# Altium project Flight-Controller.PrjPcb (part 1 of 2)
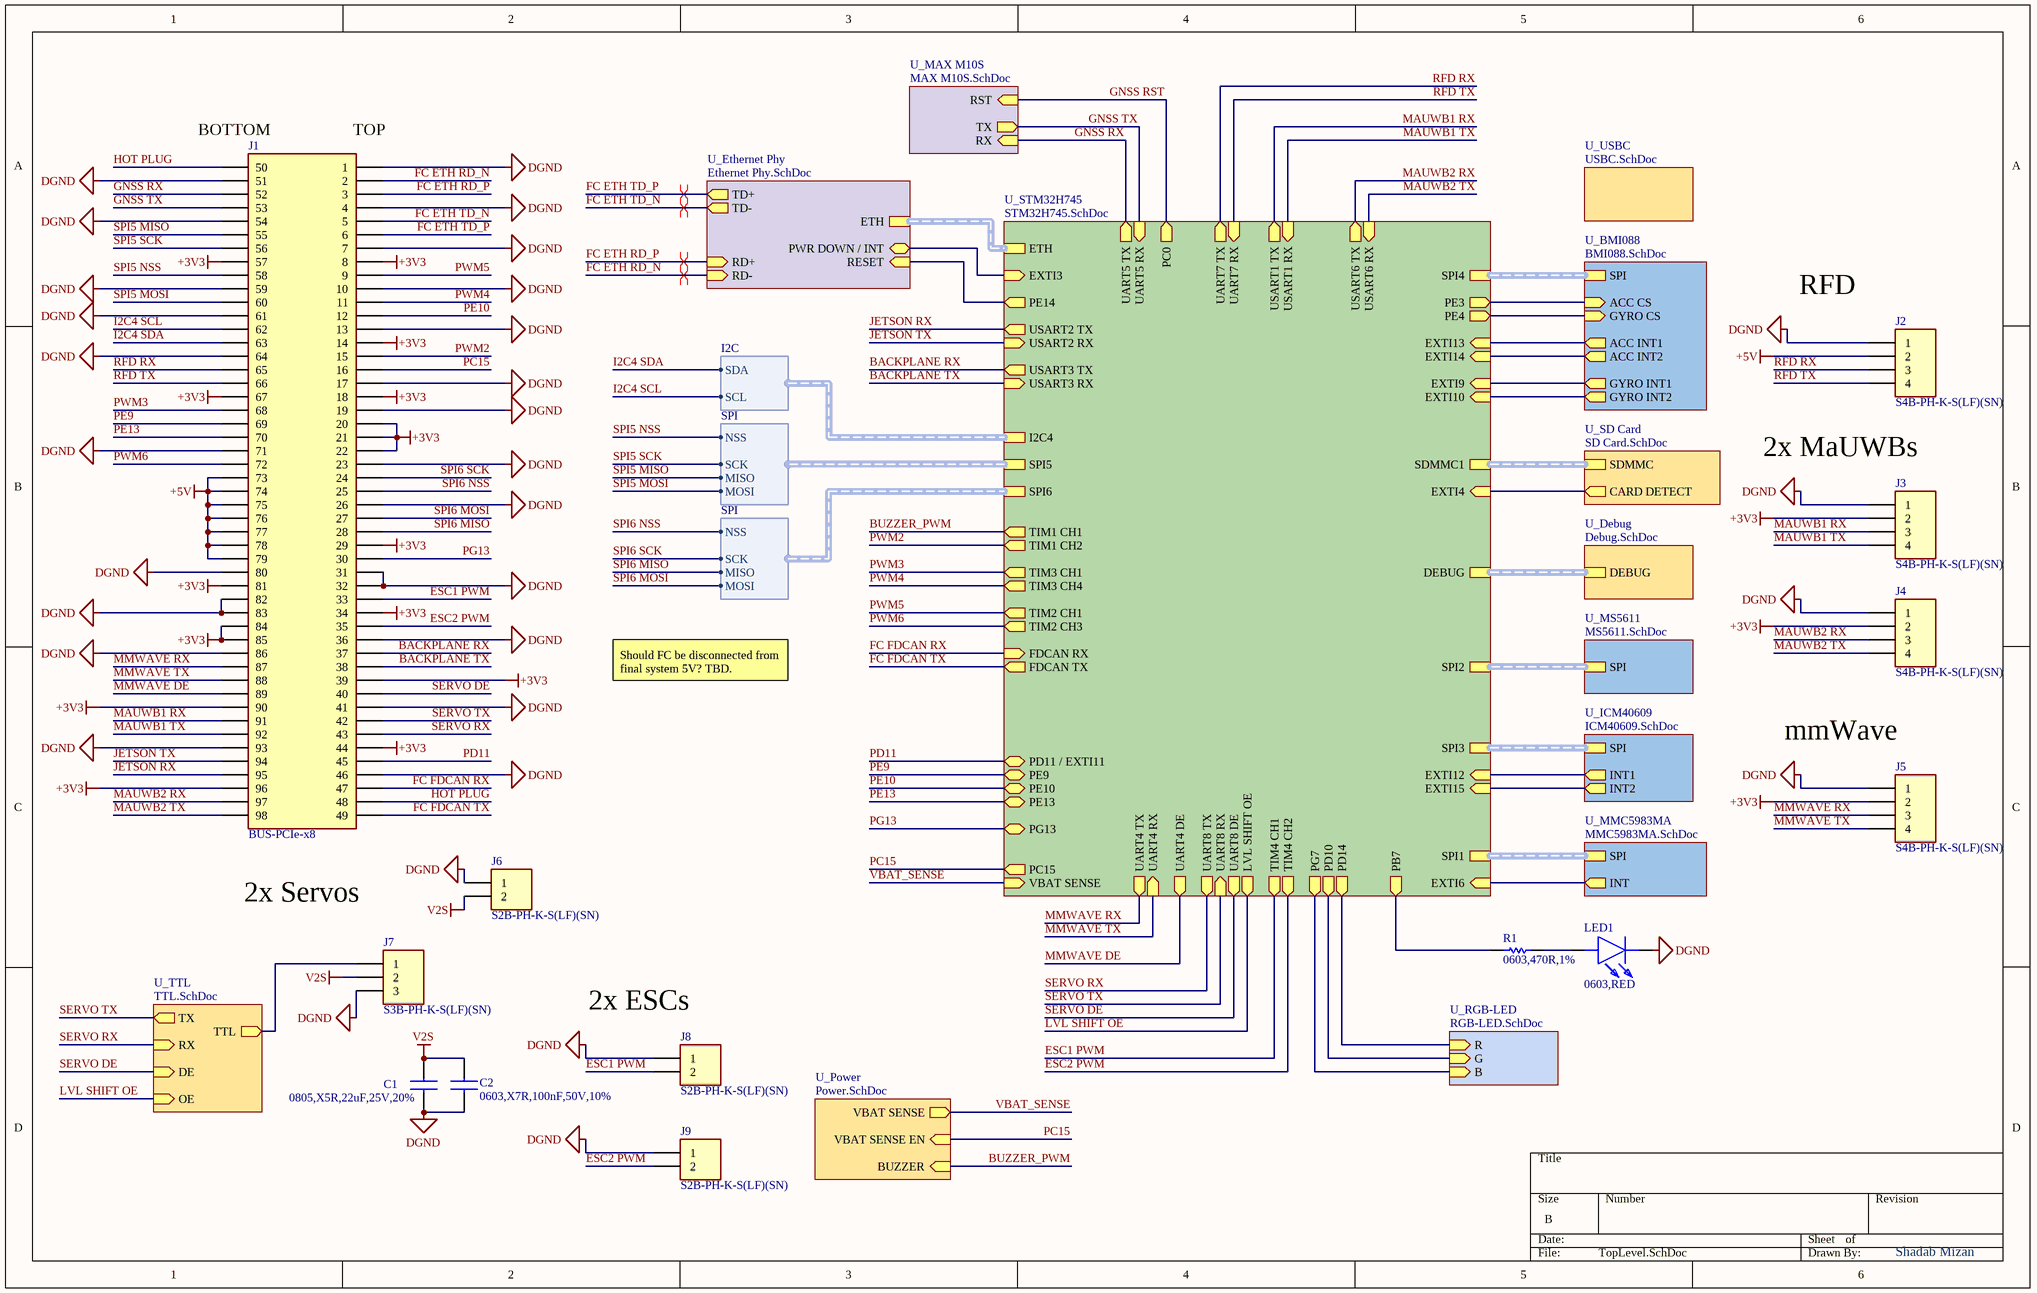
[diagram p0: TopLevel.SchDoc]
14 sheets, 188 parts. Net scope: hierarchical (ports join the sheet entries above them; power ports are global).
Board file: Flight-Controller.PcbDoc
Sheets:
  TopLevel.SchDoc
    U_STM32H745 = STM32H745.SchDoc
    U_MMC5983MA = MMC5983MA.SchDoc
    U_SD Card = SD Card.SchDoc
    U_ICM40609 = ICM40609.SchDoc
    U_MS5611 = MS5611.SchDoc
    U_MAX M10S = MAX M10S.SchDoc
    U_USBC = USBC.SchDoc
    U_BMI088 = BMI088.SchDoc
    U_Debug = Debug.SchDoc
    U_Ethernet Phy = Ethernet Phy.SchDoc
    U_TTL = TTL.SchDoc
    U_Power = Power.SchDoc
    U_RGB-LED = RGB-LED.SchDoc

## Sheet TopLevel.SchDoc
size B; SheetNumber: 1; SheetTotal: 14

### Parts
C1  0805,X5R,22uF,25V,20%  [CAPC2012X145N]
C2  0603,X7R,100nF,50V,10%  [CAPC1608X90N]
J1  BUS-PCIe-x8  [BUS_PCIexpress_x8]  (no BOM)
J2  S4B-PH-K-S(LF)(SN)  [S4B-PH-K-S-_LF_SN]
J3  S4B-PH-K-S(LF)(SN)  [S4B-PH-K-S-_LF_SN]
J4  S4B-PH-K-S(LF)(SN)  [S4B-PH-K-S-_LF_SN]
J5  S4B-PH-K-S(LF)(SN)  [S4B-PH-K-S-_LF_SN]
J6  S2B-PH-K-S(LF)(SN)  [S2B-PH-K-S_LF_SN]
J7  S3B-PH-K-S(LF)(SN)  [S3B-PH-K-S-_LF_SN]
J8  S2B-PH-K-S(LF)(SN)  [S2B-PH-K-S_LF_SN]
J9  S2B-PH-K-S(LF)(SN)  [S2B-PH-K-S_LF_SN]
LED1  0603,RED  [LEDC1608X36N]
R1  0603,470R,1%  [RESC1608X90N]

### Sub-sheets
U_BMI088 = BMI088.SchDoc: ACC CS (in), GYRO CS (in), SPI (harness SPI), ACC INT1 (out), ACC INT2 (out), GYRO INT1 (out), GYRO INT2 (out)
U_Debug = Debug.SchDoc: DEBUG (harness DEBUG)
U_Ethernet Phy = Ethernet Phy.SchDoc: ETH (harness ETH), TD+ (out), TD- (out), RD+ (in), RD- (in), PWR DOWN / INT (bidir), RESET (in)
U_ICM40609 = ICM40609.SchDoc: INT1 (out), INT2 (out), SPI (harness SPI)
U_MAX M10S = MAX M10S.SchDoc: RX (in), TX (out), RST (in)
U_MMC5983MA = MMC5983MA.SchDoc: INT (out), SPI (harness SPI)
U_MS5611 = MS5611.SchDoc: SPI (harness SPI)
U_Power = Power.SchDoc: VBAT SENSE (out), BUZZER (in), VBAT SENSE EN (in)
U_RGB-LED = RGB-LED.SchDoc: R (in), G (in), B (in)
U_SD Card = SD Card.SchDoc: SDMMC (harness SDMMC), CARD DETECT (out)
U_STM32H745 = STM32H745.SchDoc: SPI1 (harness SPI), SPI2 (harness SPI), SPI3 (harness SPI), SPI4 (harness SPI), SPI5 (harness SPI), SPI6 (harness SPI), I2C4 (harness I2C), SDMMC1 (harness SDMMC), ETH (harness ETH), PE3 (out), PE4 (out), EXTI13 (in), EXTI14 (in), EXTI9 (in), EXTI10 (in), EXTI4 (in), EXTI12 (in), EXTI15 (in), FDCAN TX (out), FDCAN RX (in), UART4 TX (out), UART4 RX (in), UART4 DE (out), UART8 TX (out), UART8 RX (in), USART6 TX (out), USART6 RX (in), USART2 TX (out), USART2 RX (in), USART3 TX (out), USART3 RX (in), UART7 TX (out), UART7 RX (in), UART5 RX (in), UART5 TX (out), EXTI6 (in), PC0 (out), TIM1 CH1 (out), TIM1 CH2 (out), TIM3 CH1 (out), TIM3 CH4 (out), DEBUG (harness SPI), TIM4 CH1 (out), TIM4 CH2 (out), TIM2 CH1 (out), TIM2 CH3 (out), EXTI3 (in), PG13 (bidir), PE10 (bidir), PE13 (bidir), UART8 DE (out), USART1 TX (out), USART1 RX (in), LVL SHIFT OE (out), PE14 (out), PD11 / EXTI11 (bidir), VBAT SENSE (in), PE9 (bidir), PC15 (out), PG7 (out), PD10 (out), PD14 (out), PB7 (out)
U_TTL = TTL.SchDoc: TX (out), OE (in), DE (in), RX (in), TTL (out)
U_USBC = USBC.SchDoc: no entries

### Harnesses
SPI: NSS, SCK, MISO, MOSI
I2C: SDA, SCL

### Nets
+3V3: J1.8 J1.14 J1.18 J1.20 J1.21 J1.22 J1.29 J1.34 J1.39 J1.44 J1.57 J1.67 J1.81 J1.84 J1.85 J1.90 J1.96 J3.2 J4.2 J5.2
+5V: J1.73 J1.74 J1.75 J1.76 J1.77 J1.78 J1.79 J2.2
DGND: C1.1 C2.1 J1.1 J1.4 J1.7 J1.10 J1.13 J1.17 J1.19 J1.23 J1.26 J1.31 J1.32 J1.36 J1.41 J1.46 J1.51 J1.54 J1.59 J1.61 J1.64 J1.71 J1.80 J1.82 J1.83 J1.86 J1.93 J2.1 J3.1 J4.1 J5.1 J6.1 J7.3 J8.1 J9.1 LED1.1(K)
V2S: C1.2 C2.2 J6.2 J7.2
BACKPLANE RX: J1.37 ; sheet U_STM32H745/USART3 TX
BACKPLANE TX: J1.38 ; sheet U_STM32H745/USART3 RX
BMI_ACC_CS: sheet U_STM32H745/PE3, sheet U_BMI088/ACC CS
BMI_ACC_INT1: sheet U_STM32H745/EXTI13, sheet U_BMI088/ACC INT1
BMI_ACC_INT2: sheet U_STM32H745/EXTI14, sheet U_BMI088/ACC INT2
BMI_GYRO_CS: sheet U_STM32H745/PE4, sheet U_BMI088/GYRO CS
BMI_GYRO_INT1: sheet U_STM32H745/EXTI9, sheet U_BMI088/GYRO INT1
BMI_GYRO_INT2: sheet U_STM32H745/EXTI10, sheet U_BMI088/GYRO INT2
BUZZER_PWM: sheet U_STM32H745/TIM1 CH1, sheet U_Power/BUZZER
ESC1 PWM: J1.33 J8.2 ; sheet U_STM32H745/TIM4 CH1
ESC2 PWM: J1.35 J9.2 ; sheet U_STM32H745/TIM4 CH2
FC ETH RD_N: J1.2 ; sheet U_Ethernet Phy/RD-
FC ETH RD_P: J1.3 ; sheet U_Ethernet Phy/RD+
FC ETH TD_N: J1.5 ; sheet U_Ethernet Phy/TD-
FC ETH TD_P: J1.6 ; sheet U_Ethernet Phy/TD+
FC FDCAN RX: J1.47 ; sheet U_STM32H745/FDCAN RX
FC FDCAN TX: J1.49 ; sheet U_STM32H745/FDCAN TX
GNSS RST: sheet U_STM32H745/PC0, sheet U_MAX M10S/RST
GNSS RX: J1.52 ; sheet U_STM32H745/UART5 TX, sheet U_MAX M10S/RX
GNSS TX: J1.53 ; sheet U_STM32H745/UART5 RX, sheet U_MAX M10S/TX
HOT PLUG: J1.48 J1.50
I2C4 SCL: J1.62 ; sheet U_STM32H745/I2C4.SCL
I2C4 SDA: J1.63 ; sheet U_STM32H745/I2C4.SDA
ICM_INT1: sheet U_STM32H745/EXTI12, sheet U_ICM40609/INT1
ICM_INT2: sheet U_STM32H745/EXTI15, sheet U_ICM40609/INT2
JETSON RX: J1.95 ; sheet U_STM32H745/USART2 TX
JETSON TX: J1.94 ; sheet U_STM32H745/USART2 RX
LVL SHIFT OE: sheet U_STM32H745/LVL SHIFT OE, sheet U_TTL/OE
MAUWB1 RX: J1.91 J3.3 ; sheet U_STM32H745/USART1 TX
MAUWB1 TX: J1.92 J3.4 ; sheet U_STM32H745/USART1 RX
MAUWB2 RX: J1.97 J4.3 ; sheet U_STM32H745/USART6 TX
MAUWB2 TX: J1.98 J4.4 ; sheet U_STM32H745/USART6 RX
MMC_INT: sheet U_STM32H745/EXTI6, sheet U_MMC5983MA/INT
MMWAVE DE: J1.89 ; sheet U_STM32H745/UART4 DE
MMWAVE RX: J1.87 J5.3 ; sheet U_STM32H745/UART4 TX
MMWAVE TX: J1.88 J5.4 ; sheet U_STM32H745/UART4 RX
PC15: J1.16 ; sheet U_STM32H745/PC15, sheet U_Power/VBAT SENSE EN
PD11: J1.45 ; sheet U_STM32H745/PD11 / EXTI11  [project net EXTRA_PD11]
PE9: J1.69 ; sheet U_STM32H745/PE9  [project net EXTRA_PE9]
PE10: J1.12 ; sheet U_STM32H745/PE10  [project net EXTRA_PE10]
PE13: J1.70 ; sheet U_STM32H745/PE13  [project net EXTRA_PE13]
PG13: J1.30 ; sheet U_STM32H745/PG13  [project net EXTRA_PG13]
PHY_INT: sheet U_STM32H745/EXTI3, sheet U_Ethernet Phy/PWR DOWN / INT
PHY_RST: sheet U_STM32H745/PE14, sheet U_Ethernet Phy/RESET
PWM2: J1.15 ; sheet U_STM32H745/TIM1 CH2
PWM3: J1.68 ; sheet U_STM32H745/TIM3 CH1
PWM4: J1.11 ; sheet U_STM32H745/TIM3 CH4
PWM5: J1.9 ; sheet U_STM32H745/TIM2 CH1
PWM6: J1.72 ; sheet U_STM32H745/TIM2 CH3
RFD RX: J1.65 J2.3 ; sheet U_STM32H745/UART7 TX
RFD TX: J1.66 J2.4 ; sheet U_STM32H745/UART7 RX
RGB_B: sheet U_STM32H745/PD10, sheet U_RGB-LED/G
RGB_G: sheet U_STM32H745/PD14, sheet U_RGB-LED/R
RGB_R: sheet U_STM32H745/PG7, sheet U_RGB-LED/B
SD_CARD_DETECT: sheet U_STM32H745/EXTI4, sheet U_SD Card/CARD DETECT
SERVO DE: J1.40 ; sheet U_STM32H745/UART8 DE, sheet U_TTL/DE
SERVO RX: J1.43 ; sheet U_STM32H745/UART8 TX, sheet U_TTL/RX
SERVO TX: J1.42 ; sheet U_STM32H745/UART8 RX, sheet U_TTL/TX
SPI5 MISO: J1.55 ; sheet U_STM32H745/SPI5.MISO
SPI5 MOSI: J1.60 ; sheet U_STM32H745/SPI5.MOSI
SPI5 NSS: J1.58 ; sheet U_STM32H745/SPI5.NSS
SPI5 SCK: J1.56 ; sheet U_STM32H745/SPI5.SCK
SPI6 MISO: J1.28 ; sheet U_STM32H745/SPI6.MISO
SPI6 MOSI: J1.27 ; sheet U_STM32H745/SPI6.MOSI
SPI6 NSS: J1.25 ; sheet U_STM32H745/SPI6.NSS
SPI6 SCK: J1.24 ; sheet U_STM32H745/SPI6.SCK
STAT_LEDR: R1.1 ; sheet U_STM32H745/PB7
VBAT_SENSE: sheet U_STM32H745/VBAT SENSE, sheet U_Power/VBAT SENSE  [project net ADC1_INP9]
NetIC12_2: J7.1 ; sheet U_TTL/TTL
NetLED1_2: LED1.2(A) R1.2

### Buses and harness runs
harness sheet U_BMI088/SPI = sheet U_STM32H745/SPI4
harness sheet U_Debug/DEBUG = sheet U_STM32H745/DEBUG
harness sheet U_Ethernet Phy/ETH = sheet U_STM32H745/ETH
harness sheet U_ICM40609/SPI = sheet U_STM32H745/SPI3
harness sheet U_MMC5983MA/SPI = sheet U_STM32H745/SPI1
harness sheet U_MS5611/SPI = sheet U_STM32H745/SPI2
harness sheet U_SD Card/SDMMC = sheet U_STM32H745/SDMMC1

### Layout directives
differential pair: FC ETH RD_N, FC ETH RD_P, FC ETH TD_N, FC ETH TD_P

### Notes on the sheet
- (near J1) BOTTOM
- (near J1) TOP
- RFD
- 2x MaUWBs
- Should FC be disconnected from final system 5V? TBD.
- mmWave
- 2x Servos
- (near J8) 2x ESCs
- Shadab Mizan

### Library data of the parts
C1 = CL21A226MAQNNNE: 22uF ±20% 25V Ceramic Capacitor X5R 0805; LCSC Part #: C45783; Manu Part #: CL21A226MAQNNNE
C2 = CC0603KRX7R9BB104: 50V 100nF X7R ±10% 0603 Multilayer Ceramic Capacitors MLCC - SMD/SMT ROHS; LCSC Part #: C14663; Manu Part #: CC0603KRX7R9BB104
J1 = BUS-PCIe-x8: PCIe x8
J2-J5 = S4B-PH-K-S(LF)(SN): Connector Header 4 position 2mm Pitch 2A Right Angle -25℃~+85℃; LCSC Part #: C157926; Manu Part #: S4B-PH-K-S(LF)(SN)
J6 J8 J9 = S2B-PH-K-S(LF)(SN): Connector Header 2 position 2mm Pitch 2A Right Angle -25℃~+85℃; LCSC Part #: C173752; Manu Part #: S2B-PH-K-S(LF)(SN)
J7 = S3B-PH-K-S(LF)(SN): Connector Header 3 position 2mm Pitch 2A Right Angle -25℃~+85℃; LCSC Part #: C157929; Manu Part #: S3B-PH-K-S(LF)(SN)
LED1 = KT-0603R: -40℃~+85℃ 1.8V~2.4V 120° 20mA 300mcd 40mW 615nm~630nm 645nm Discrete Diode Red Water Clear 0603 LED Indication - Discrete ROHS; Manu Part #: KT-0603R; LCSC Part #: C2286
R1 = 0603WAF4700T5E: -55℃~+155℃ 100mW 470Ω 75V Thick Film Resistor ±1% ±100ppm/℃ 0603 Chip Resistor - Surface Mount ROHS; LCSC Part #: C23179; Manu Part #: 0603WAF4700T5E

## Sheet STM32H745.SchDoc
size C; SheetNumber: 2; SheetTotal: 14
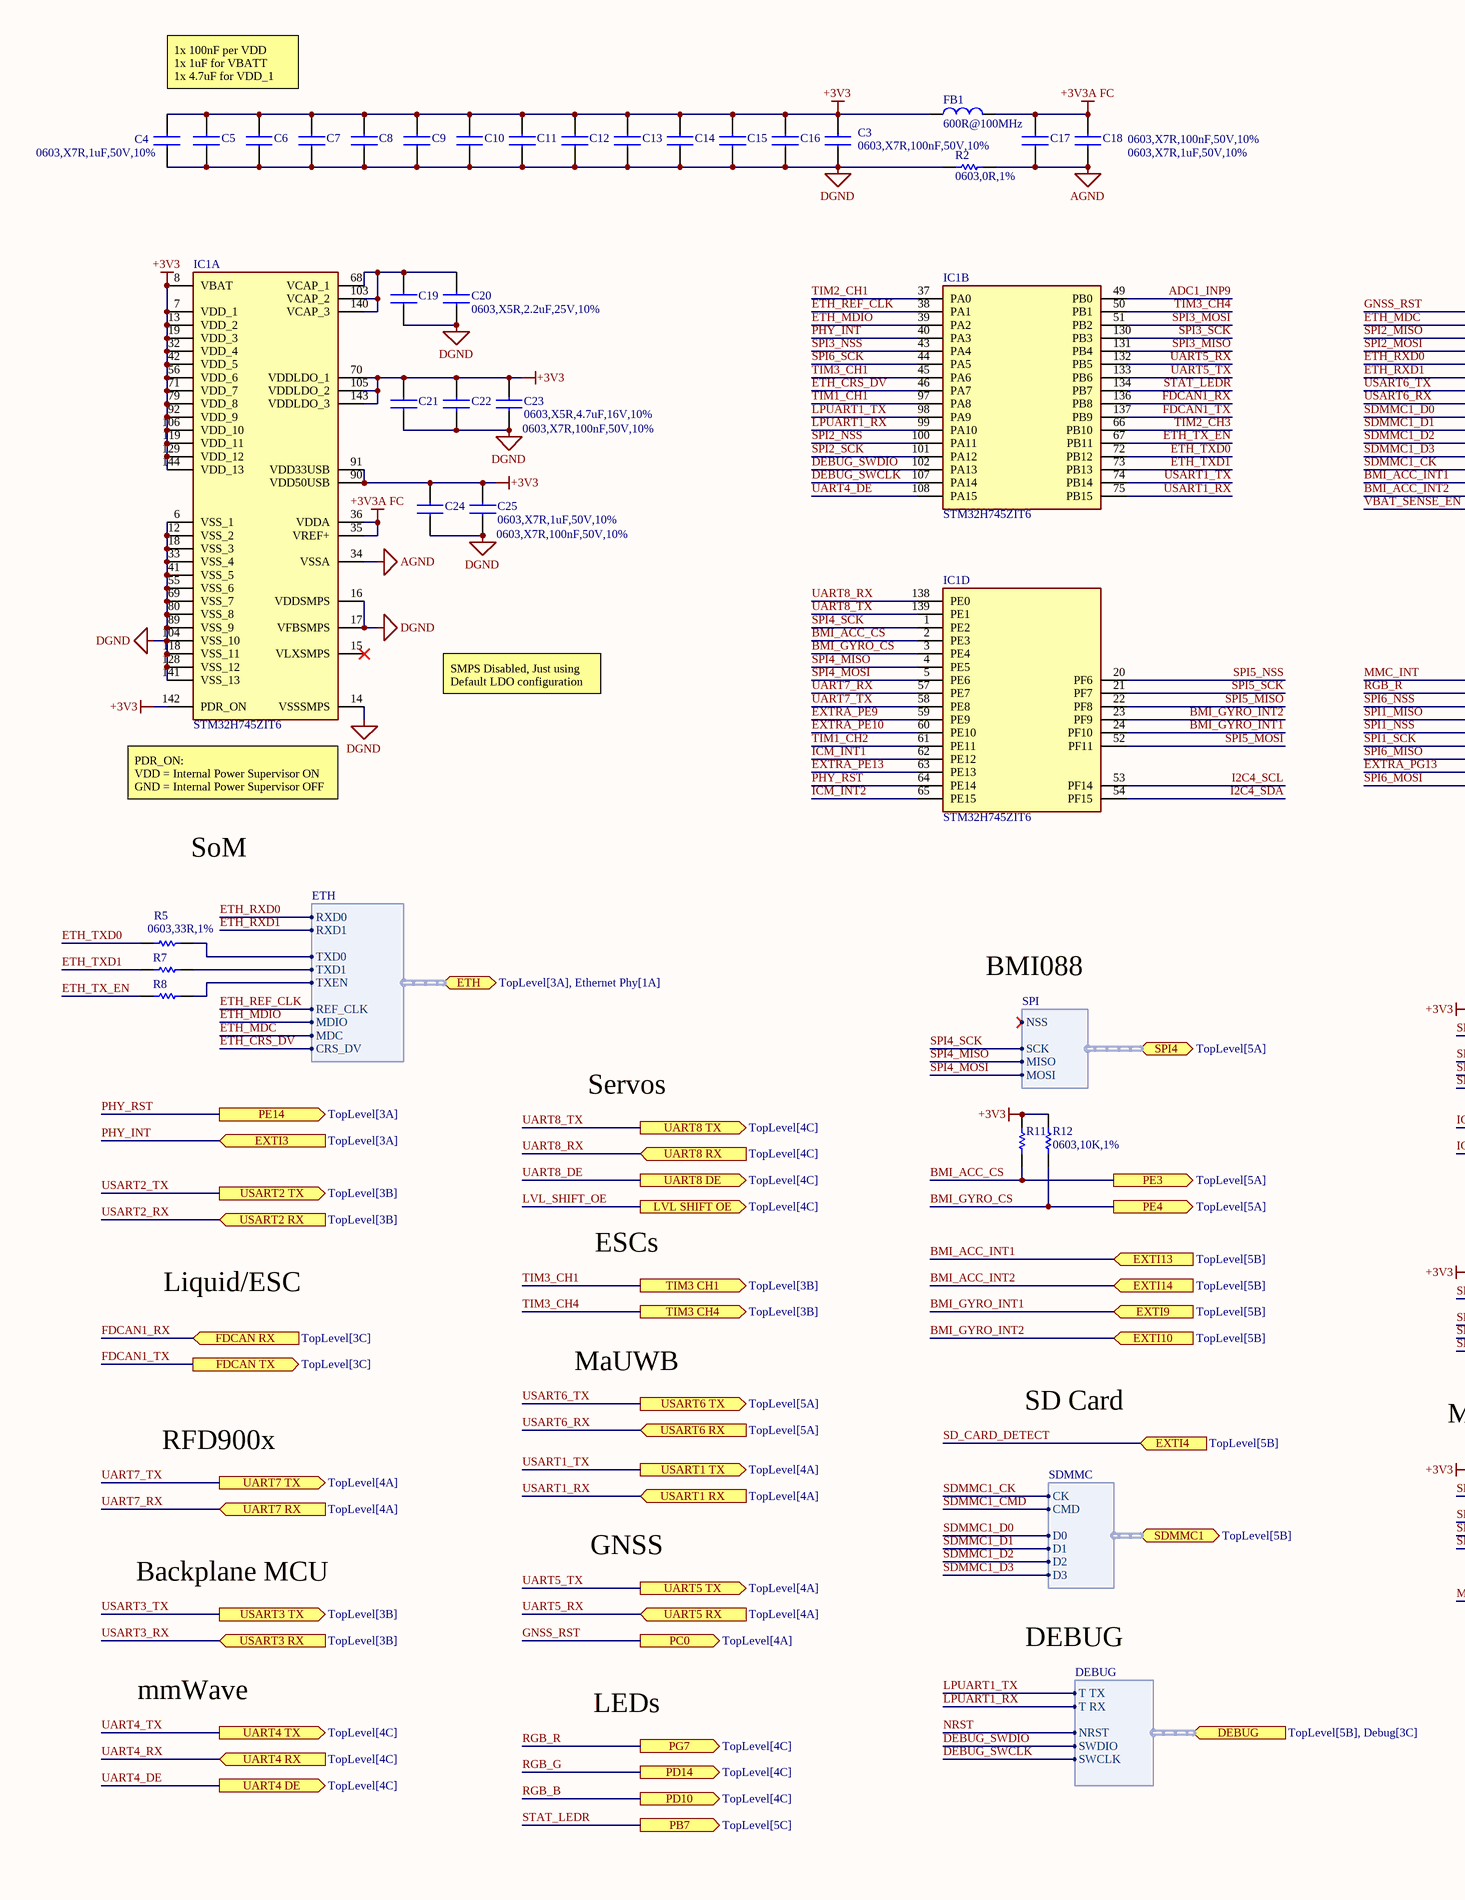
[diagram p1: STM32H745.SchDoc, left]
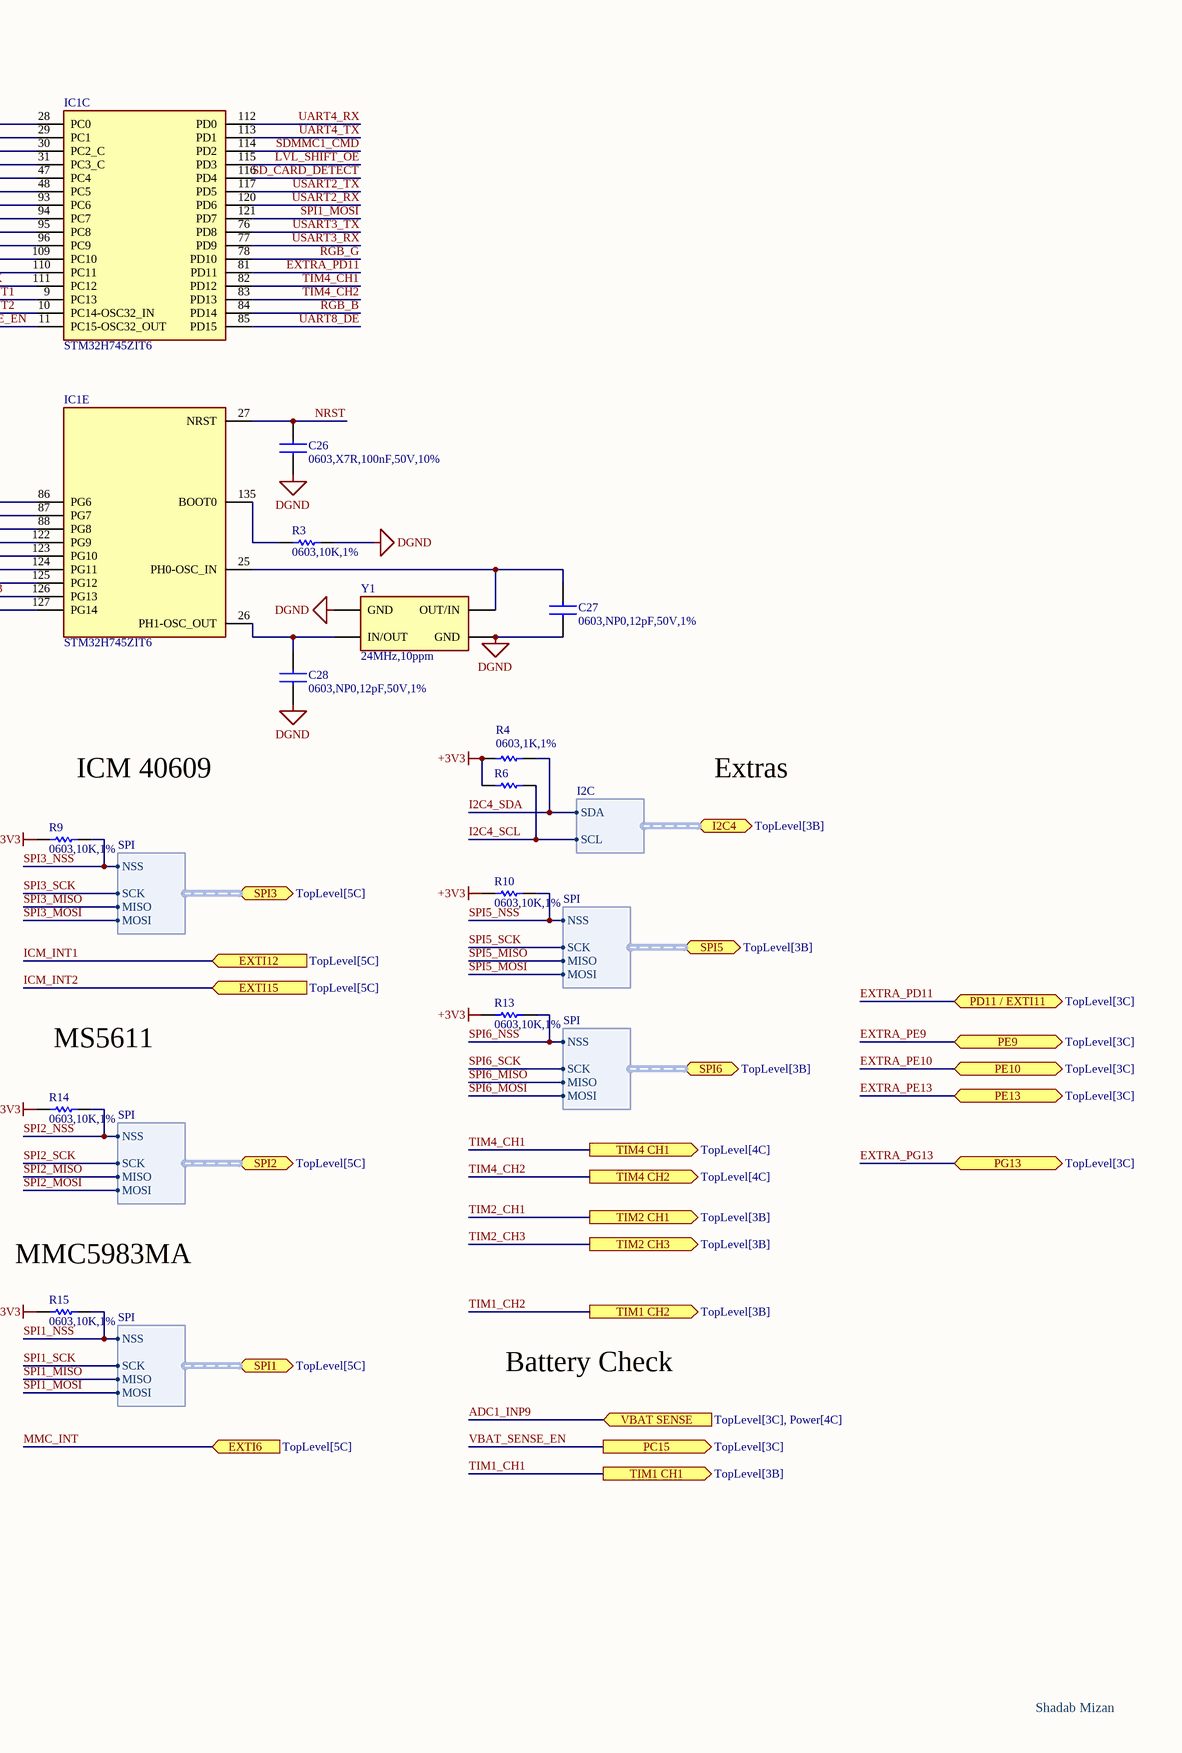
[diagram p2: STM32H745.SchDoc, right]

### Parts
C3  0603,X7R,100nF,50V,10%  [CAPC1608X90N]
C4  0603,X7R,1uF,50V,10%  [CAPC1608X90N]
C5  0603,X7R,100nF,50V,10%  [CAPC1608X90N]  (value not drawn)
C6  0603,X7R,100nF,50V,10%  [CAPC1608X90N]  (value not drawn)
C7  0603,X7R,100nF,50V,10%  [CAPC1608X90N]  (value not drawn)
C8  0603,X7R,100nF,50V,10%  [CAPC1608X90N]  (value not drawn)
C9  0603,X7R,100nF,50V,10%  [CAPC1608X90N]  (value not drawn)
C10  0603,X7R,100nF,50V,10%  [CAPC1608X90N]  (value not drawn)
C11  0603,X7R,100nF,50V,10%  [CAPC1608X90N]  (value not drawn)
C12  0603,X7R,100nF,50V,10%  [CAPC1608X90N]  (value not drawn)
C13  0603,X7R,100nF,50V,10%  [CAPC1608X90N]  (value not drawn)
C14  0603,X7R,100nF,50V,10%  [CAPC1608X90N]  (value not drawn)
C15  0603,X7R,100nF,50V,10%  [CAPC1608X90N]  (value not drawn)
C16  0603,X7R,100nF,50V,10%  [CAPC1608X90N]  (value not drawn)
C17  0603,X7R,100nF,50V,10%  [CAPC1608X90N]
C18  0603,X7R,1uF,50V,10%  [CAPC1608X90N]
C19  0603,X5R,2.2uF,25V,10%  [CAPC1608X90N]  (value not drawn)
C20  0603,X5R,2.2uF,25V,10%  [CAPC1608X90N]
C21  0603,X7R,100nF,50V,10%  [CAPC1608X90N]  (value not drawn)
C22  0603,X7R,100nF,50V,10%  [CAPC1608X90N]
C23  0603,X5R,4.7uF,16V,10%  [CAPC1608X90N]
C24  0603,X7R,100nF,50V,10%  [CAPC1608X90N]
C25  0603,X7R,1uF,50V,10%  [CAPC1608X90N]
C26  0603,X7R,100nF,50V,10%  [CAPC1608X90N]
C27  0603,NP0,12pF,50V,1%  [CAPC1608X90N]
C28  0603,NP0,12pF,50V,1%  [CAPC1608X90N]
FB1  600R@100MHz  [BLM18SP221SN1B]
IC1  STM32H745ZIT6  [QFP50P2200X2200X160-144N]  (parts A,B,C,D,E of 5)
R2  0603,0R,1%  [RESC1608X90N]
R3  0603,10K,1%  [RESC1608X90N]
R4  0603,1K,1%  [RESC1608X90N]
R5  0603,33R,1%  [RESC1608X90N]
R6  0603,1K,1%  [RESC1608X90N]  (value not drawn)
R7  0603,33R,1%  [RESC1608X90N]  (value not drawn)
R8  0603,33R,1%  [RESC1608X90N]  (value not drawn)
R9  0603,10K,1%  [RESC1608X90N]
R10  0603,10K,1%  [RESC1608X90N]
R11  0603,10K,1%  [RESC1608X90N]  (value not drawn)
R12  0603,10K,1%  [RESC1608X90N]
R13  0603,10K,1%  [RESC1608X90N]
R14  0603,10K,1%  [RESC1608X90N]
R15  0603,10K,1%  [RESC1608X90N]
Y1  24MHz,10ppm  [CRYSTAL-SMD_4P-L3.2-W2.5-BL]

### Ports
DEBUG (in, harness DEBUG, see TopLevel[5B], Debug[3C]), ETH (bidir, harness ETH, see TopLevel[3A], Ethernet Phy[1A]), EXTI3 (in, see TopLevel[3A]), EXTI4 (in, see TopLevel[5B]), EXTI6 (in, see TopLevel[5C]), EXTI9 (in, see TopLevel[5B]), EXTI10 (in, see TopLevel[5B]), EXTI12 (in, see TopLevel[5C]), EXTI13 (in, see TopLevel[5B]), EXTI14 (in, see TopLevel[5B]), EXTI15 (in, see TopLevel[5C]), FDCAN RX (in, see TopLevel[3C]), FDCAN TX (out, see TopLevel[3C]), I2C4 (bidir, harness I2C, see TopLevel[3B]), LVL SHIFT OE (out, see TopLevel[4C]), PB7 (out, see TopLevel[5C]), PC0 (out, see TopLevel[4A]), PC15 (out, see TopLevel[3C]), PD10 (out, see TopLevel[4C]), PD11 / EXTI11 (bidir, see TopLevel[3C]), PD14 (out, see TopLevel[4C]), PE3 (out, see TopLevel[5A]), PE4 (out, see TopLevel[5A]), PE9 (bidir, see TopLevel[3C]), PE10 (bidir, see TopLevel[3C]), PE13 (bidir, see TopLevel[3C]), PE14 (out, see TopLevel[3A]), PG7 (out, see TopLevel[4C]), PG13 (bidir, see TopLevel[3C]), SDMMC1 (bidir, harness SDMMC, see TopLevel[5B]), SPI1 (bidir, harness SPI, see TopLevel[5C]), SPI2 (bidir, harness SPI, see TopLevel[5C]), SPI3 (bidir, harness SPI, see TopLevel[5C]), SPI4 (bidir, harness SPI, see TopLevel[5A]), SPI5 (bidir, harness SPI, see TopLevel[3B]), SPI6 (bidir, harness SPI, see TopLevel[3B]), TIM1 CH1 (out, see TopLevel[3B]), TIM1 CH2 (out, see TopLevel[3B]), TIM2 CH1 (out, see TopLevel[3B]), TIM2 CH3 (out, see TopLevel[3B]), TIM3 CH1 (out, see TopLevel[3B]), TIM3 CH4 (out, see TopLevel[3B]), TIM4 CH1 (out, see TopLevel[4C]), TIM4 CH2 (out, see TopLevel[4C]), UART4 DE (out, see TopLevel[4C]), UART4 RX (in, see TopLevel[4C]), UART4 TX (out, see TopLevel[4C]), UART5 RX (in, see TopLevel[4A]), UART5 TX (out, see TopLevel[4A]), UART7 RX (in, see TopLevel[4A]), UART7 TX (out, see TopLevel[4A]), UART8 DE (out, see TopLevel[4C]), UART8 RX (in, see TopLevel[4C]), UART8 TX (out, see TopLevel[4C]), USART1 RX (in, see TopLevel[4A]), USART1 TX (out, see TopLevel[4A]), USART2 RX (in, see TopLevel[3B]), USART2 TX (out, see TopLevel[3B]), USART3 RX (in, see TopLevel[3B]), USART3 TX (out, see TopLevel[3B]), USART6 RX (in, see TopLevel[5A]), USART6 TX (out, see TopLevel[5A]), VBAT SENSE (in, see TopLevel[3C], Power[4C])

### Harnesses
SPI: NSS, SCK, MISO, MOSI
I2C: SDA, SCL
SDMMC: CK, CMD, D0, D1, D2, D3
ETH: RXD0, RXD1, TXD0, TXD1, REF_CLK, MDIO, MDC, CRS_DV, TXEN
DEBUG: T TX, T RX, NRST, SWDIO, SWCLK

### Nets
+3V3: C3.2 C4.2 C5.2 C6.2 C7.2 C8.2 C9.2 C10.2 C11.2 C12.2 C13.2 C14.2 C15.2 C16.2 C21.2 C22.2 C23.2 C24.2 C25.2 FB1.1 IC1.7(VDD_1) IC1.8(VBAT) IC1.13(VDD_2) IC1.19(VDD_3) IC1.32(VDD_4) IC1.42(VDD_5) IC1.56(VDD_6) IC1.70(VDDLDO_1) IC1.71(VDD_7) IC1.79(VDD_8) IC1.90(VDD50USB) IC1.91(VDD33USB) IC1.92(VDD_9) IC1.105(VDDLDO_2) IC1.106(VDD_10) IC1.119(VDD_11) IC1.129(VDD_12) IC1.142(PDR_ON) IC1.143(VDDLDO_3) IC1.144(VDD_13) R4.1 R6.1 R9.1 R10.1 R11.2 R12.2 R13.1 R14.1 R15.1
+3V3A FC: C17.2 C18.2 FB1.2 IC1.35(VREF+) IC1.36(VDDA)
AGND: C17.1 C18.1 IC1.34(VSSA) R2.2
DGND: C3.1 C4.1 C5.1 C6.1 C7.1 C8.1 C9.1 C10.1 C11.1 C12.1 C13.1 C14.1 C15.1 C16.1 C19.1 C20.1 C21.1 C22.1 C23.1 C24.1 C25.1 C26.1 C27.1 C28.1 IC1.6(VSS_1) IC1.12(VSS_2) IC1.14(VSSSMPS) IC1.16(VDDSMPS) IC1.17(VFBSMPS) IC1.18(VSS_3) IC1.33(VSS_4) IC1.41(VSS_5) IC1.55(VSS_6) IC1.69(VSS_7) IC1.80(VSS_8) IC1.89(VSS_9) IC1.104(VSS_10) IC1.118(VSS_11) IC1.128(VSS_12) IC1.141(VSS_13) R2.1 R3.2 Y1.2(GND) Y1.4(GND)
ADC1_INP9: IC1.49(PB0) ; port VBAT SENSE
BMI_ACC_CS: IC1.2(PE3) R11.1 ; port PE3
BMI_ACC_INT1: IC1.9(PC13) ; port EXTI13
BMI_ACC_INT2: IC1.10(PC14-OSC32_IN) ; port EXTI14
BMI_GYRO_CS: IC1.3(PE4) R12.1 ; port PE4
BMI_GYRO_INT1: IC1.24(PF10) ; port EXTI9
BMI_GYRO_INT2: IC1.23(PF9) ; port EXTI10
DEBUG_SWCLK: IC1.107(PA14) ; port DEBUG.SWCLK
DEBUG_SWDIO: IC1.102(PA13) ; port DEBUG.SWDIO
ETH_CRS_DV: IC1.46(PA7) ; port ETH.CRS_DV  [project net CRS_DV]
ETH_MDC: IC1.29(PC1) ; port ETH.MDC
ETH_MDIO: IC1.39(PA2) ; port ETH.MDIO
ETH_REF_CLK: IC1.38(PA1) ; port ETH.REF_CLK
ETH_RXD0: IC1.47(PC4) ; port ETH.RXD0
ETH_RXD1: IC1.48(PC5) ; port ETH.RXD1
ETH_TX_EN: IC1.67(PB11) R8.1
ETH_TXD0: IC1.72(PB12) R5.1
ETH_TXD1: IC1.73(PB13) R7.1
EXTRA_PD11: IC1.81(PD11) ; port PD11 / EXTI11
EXTRA_PE9: IC1.59(PE9) ; port PE9
EXTRA_PE10: IC1.60(PE10) ; port PE10
EXTRA_PE13: IC1.63(PE13) ; port PE13
EXTRA_PG13: IC1.126(PG13) ; port PG13
FDCAN1_RX: IC1.136(PB8) ; port FDCAN RX  [project net FC FDCAN RX]
FDCAN1_TX: IC1.137(PB9) ; port FDCAN TX  [project net FC FDCAN TX]
GNSS_RST: IC1.28(PC0) ; port PC0  [project net GNSS RST]
I2C4_SCL: IC1.53(PF14) R6.2 ; port I2C4.SCL  [project net I2C4 SCL]
I2C4_SDA: IC1.54(PF15) R4.2 ; port I2C4.SDA  [project net I2C4 SDA]
ICM_INT1: IC1.62(PE12) ; port EXTI12
ICM_INT2: IC1.65(PE15) ; port EXTI15
LPUART1_RX: IC1.99(PA10) ; port DEBUG.T RX
LPUART1_TX: IC1.98(PA9) ; port DEBUG.T TX
LVL_SHIFT_OE: IC1.115(PD3) ; port LVL SHIFT OE  [project net LVL SHIFT OE]
MMC_INT: IC1.86(PG6) ; port EXTI6
NRST: C26.2 IC1.27(NRST) ; port DEBUG.NRST
PHY_INT: IC1.40(PA3) ; port EXTI3
PHY_RST: IC1.64(PE14) ; port PE14
RGB_B: IC1.84(PD14) ; port PD10
RGB_G: IC1.78(PD10) ; port PD14
RGB_R: IC1.87(PG7) ; port PG7
SD_CARD_DETECT: IC1.116(PD4) ; port EXTI4
SDMMC1_CK: IC1.111(PC12) ; port SDMMC1.CK
SDMMC1_CMD: IC1.114(PD2) ; port SDMMC1.CMD
SDMMC1_D0: IC1.95(PC8) ; port SDMMC1.D0
SDMMC1_D1: IC1.96(PC9) ; port SDMMC1.D1
SDMMC1_D2: IC1.109(PC10) ; port SDMMC1.D2
SDMMC1_D3: IC1.110(PC11) ; port SDMMC1.D3
SPI1_MISO: IC1.122(PG9) ; port SPI1.MISO
SPI1_MOSI: IC1.121(PD7) ; port SPI1.MOSI
SPI1_NSS: IC1.123(PG10) R15.2 ; port SPI1.NSS
SPI1_SCK: IC1.124(PG11) ; port SPI1.SCK
SPI2_MISO: IC1.30(PC2_C) ; port SPI2.MISO
SPI2_MOSI: IC1.31(PC3_C) ; port SPI2.MOSI
SPI2_NSS: IC1.100(PA11) R14.2 ; port SPI2.NSS
SPI2_SCK: IC1.101(PA12) ; port SPI2.SCK
SPI3_MISO: IC1.131(PB4) ; port SPI3.MISO
SPI3_MOSI: IC1.51(PB2) ; port SPI3.MOSI
SPI3_NSS: IC1.43(PA4) R9.2 ; port SPI3.NSS
SPI3_SCK: IC1.130(PB3) ; port SPI3.SCK
SPI4_MISO: IC1.4(PE5) ; port SPI4.MISO
SPI4_MOSI: IC1.5(PE6) ; port SPI4.MOSI
SPI4_SCK: IC1.1(PE2) ; port SPI4.SCK
SPI5_MISO: IC1.22(PF8) ; port SPI5.MISO  [project net SPI5 MISO]
SPI5_MOSI: IC1.52(PF11) ; port SPI5.MOSI  [project net SPI5 MOSI]
SPI5_NSS: IC1.20(PF6) R10.2 ; port SPI5.NSS  [project net SPI5 NSS]
SPI5_SCK: IC1.21(PF7) ; port SPI5.SCK  [project net SPI5 SCK]
SPI6_MISO: IC1.125(PG12) ; port SPI6.MISO  [project net SPI6 MISO]
SPI6_MOSI: IC1.127(PG14) ; port SPI6.MOSI  [project net SPI6 MOSI]
SPI6_NSS: IC1.88(PG8) R13.2 ; port SPI6.NSS  [project net SPI6 NSS]
SPI6_SCK: IC1.44(PA5) ; port SPI6.SCK  [project net SPI6 SCK]
STAT_LEDR: IC1.134(PB7) ; port PB7
TIM1_CH1: IC1.97(PA8) ; port TIM1 CH1  [project net BUZZER_PWM]
TIM1_CH2: IC1.61(PE11) ; port TIM1 CH2  [project net PWM2]
TIM2_CH1: IC1.37(PA0) ; port TIM2 CH1  [project net PWM5]
TIM2_CH3: IC1.66(PB10) ; port TIM2 CH3  [project net PWM6]
TIM3_CH1: IC1.45(PA6) ; port TIM3 CH1  [project net PWM3]
TIM3_CH4: IC1.50(PB1) ; port TIM3 CH4  [project net PWM4]
TIM4_CH1: IC1.82(PD12) ; port TIM4 CH1  [project net ESC1 PWM]
TIM4_CH2: IC1.83(PD13) ; port TIM4 CH2  [project net ESC2 PWM]
TXD0: R5.2 ; port ETH.TXD0
TXD1: R7.2 ; port ETH.TXD1
TXEN: R8.2 ; port ETH.TXEN
UART4_DE: IC1.108(PA15) ; port UART4 DE  [project net MMWAVE DE]
UART4_RX: IC1.112(PD0) ; port UART4 RX  [project net MMWAVE TX]
UART4_TX: IC1.113(PD1) ; port UART4 TX  [project net MMWAVE RX]
UART5_RX: IC1.132(PB5) ; port UART5 RX  [project net GNSS TX]
UART5_TX: IC1.133(PB6) ; port UART5 TX  [project net GNSS RX]
UART7_RX: IC1.57(PE7) ; port UART7 RX  [project net RFD TX]
UART7_TX: IC1.58(PE8) ; port UART7 TX  [project net RFD RX]
UART8_DE: IC1.85(PD15) ; port UART8 DE  [project net SERVO DE]
UART8_RX: IC1.138(PE0) ; port UART8 RX  [project net SERVO TX]
UART8_TX: IC1.139(PE1) ; port UART8 TX  [project net SERVO RX]
USART1_RX: IC1.75(PB15) ; port USART1 RX  [project net MAUWB1 TX]
USART1_TX: IC1.74(PB14) ; port USART1 TX  [project net MAUWB1 RX]
USART2_RX: IC1.120(PD6) ; port USART2 RX  [project net JETSON TX]
USART2_TX: IC1.117(PD5) ; port USART2 TX  [project net JETSON RX]
USART3_RX: IC1.77(PD9) ; port USART3 RX  [project net BACKPLANE TX]
USART3_TX: IC1.76(PD8) ; port USART3 TX  [project net BACKPLANE RX]
USART6_RX: IC1.94(PC7) ; port USART6 RX  [project net MAUWB2 TX]
USART6_TX: IC1.93(PC6) ; port USART6 TX  [project net MAUWB2 RX]
VBAT_SENSE_EN: IC1.11(PC15-OSC32_OUT) ; port PC15  [project net PC15]
NetC19_2: C19.2 C20.2 IC1.68(VCAP_1) IC1.103(VCAP_2) IC1.140(VCAP_3)
NetC27_2: C27.2 IC1.25(PH0-OSC_IN) Y1.3(OUT/IN)
NetC28_2: C28.2 IC1.26(PH1-OSC_OUT) Y1.1(IN/OUT)
NetIC1_135: IC1.135(BOOT0) R3.1

Not connected (* = marked no-connect by the designer): IC1 15(VLXSMPS)*

### Notes on the sheet
- 1x 100nF per VDD
  1x 1uF for VBATT
  1x 4.7uF for VDD_1
- SMPS Disabled, Just using Default LDO configuration
- (near IC1) PDR_ON:
  VDD = Internal Power Supervisor ON
  GND = Internal Power Supervisor OFF
- SoM
- BMI088
- ICM 40609
- Extras
- Servos
- ESCs
- MS5611
- Liquid/ESC
- MaUWB
- RFD900x
- SD Card
- (near R15) MMC5983MA
- Battery Check
- Backplane MCU
- GNSS
- DEBUG
- mmWave
- LEDs
- Shadab Mizan

### Library data of the parts
C3 C5-C17 C21 C22 C24 C26 = CC0603KRX7R9BB104: as C2 on sheet TopLevel; LCSC Part #: C14663; Manu Part #: CC0603KRX7R9BB104
C4 C18 C25 = CL10A105KB8NNNC: 50V 1uF X7R ±10% 0603 Multilayer Ceramic Capacitors MLCC - SMD/SMT ROHS; LCSC Part #: C15849; Manu Part #: CL10A105KB8NNNC
C19 C20 = CL10A225KO8NNNC: 2.2 µF ±10% 25V Ceramic Capacitor X5R 0603 (1608 Metric); Manu Part #: CL10A225KO8NNNC; LCSC Part #: C23630
C23 = CL10A475KO8NNNC: 16V 4.7uF X5R ±10% 0603 Multilayer Ceramic Capacitors MLCC - SMD/SMT ROHS; LCSC Part #: C19666; Manu Part #: CL10A475KO8NNNC
C27 C28 = CL10C120JB8NNNC: 12pF ±1% 50V Ceramic Capacitor NP0 0603; LCSC Part #: C38523; Manu Part #: CL10C120JB8NNNC
FB1 = BLM18AG601SN1D: 380mΩ ±25% 600Ω@100MHz 0603 Ferrite Beads ROHS; LCSC Part #: C19330; Manu Part #: BLM18AG601SN1D
IC1 = STM32H745ZIT6: Dual 32-bit Arm Cortex-M7 and -M4 MCUs, up to 2MB Flash, 1MB RAM, 46 com. and analog interfaces, SMPS; Manu Part #: STM32H745ZIT6; LCSC Part #: C730193
R2 = 0603WAF0000T5E: 0Ω 100mW 75V Thick Film Resistor ±1% 0603 Chip Resistor - Surface Mount RoHS; LCSC Part #: C21189; Manu Part #: 0603WAF0000T5E
R3 R9-R15 = 0603WAF1002T5E: 100mW Thick Film Resistor 75V ±100ppm/℃ ±1% 10kΩ 0603 Chip Resistor - Surface Mount ROHS; LCSC Part #: C25804; Manu Part #: 0603WAF1002T5E
R4 R6 = 0603WAF1001T5E: 100mW 1kΩ 75V Thick Film Resistor ±100ppm/℃ ±1% 0603 Chip Resistor - Surface Mount RoHS; LCSC Part #: C21190; Manu Part #: 0603WAF1001T5E
R5 R7 R8 = 0603WAF330JT5E: 100mW 33Ω 75V Thick Film Resistor ±100ppm/℃ ±1% 0603 Chip Resistor - Surface Mount RoHS; LCSC Part #: C23140; Manu Part #: 0603WAF330JT5E
Y1 = XC32M4-24.000-F12NJDTL: Crystal 24MHz ±10ppm 12pF 50Ω SMD3225-4P; Manu Part #: XC32M4-24.000-F12NJDTL; LCSC Part #: C5122304

## Sheet MMC5983MA.SchDoc
size A; SheetNumber: 7; SheetTotal: 14
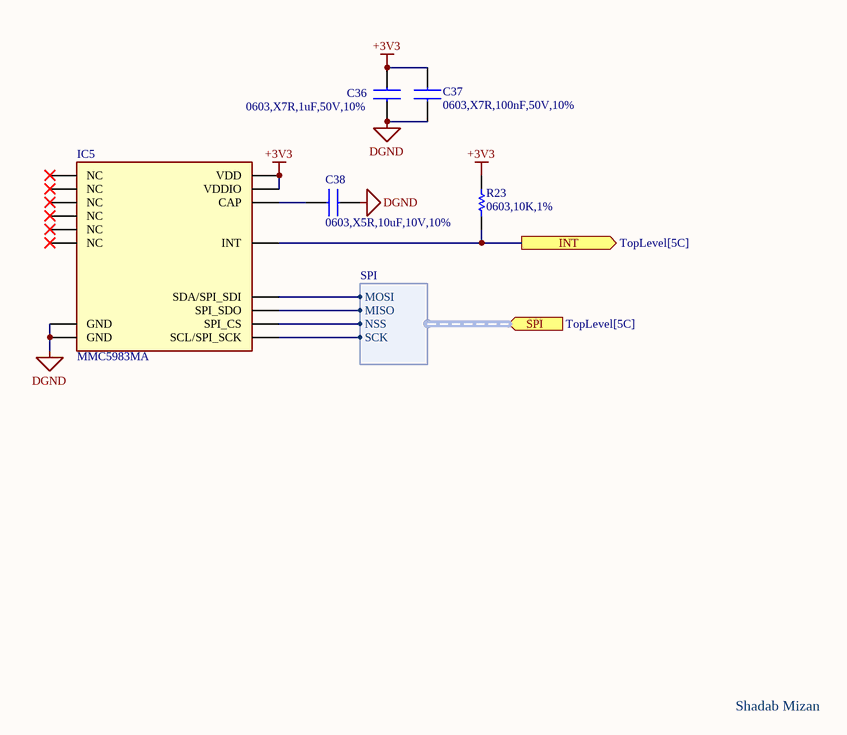
[diagram p3: MMC5983MA.SchDoc]

### Parts
C36  0603,X7R,1uF,50V,10%  [CAPC1608X90N]
C37  0603,X7R,100nF,50V,10%  [CAPC1608X90N]
C38  0603,X5R,10uF,10V,10%  [CAPC1608X90N]
IC5  MMC5983MA  [LGA-16_L3.0-W3.0-P0.50-BL_SQ]
R23  0603,10K,1%  [RESC1608X90N]

### Ports
INT (out, see TopLevel[5C]), SPI (in, harness SPI, see TopLevel[5C])

### Harnesses
SPI: NSS, SCK, MISO, MOSI

### Nets
+3V3: C36.2 C37.2 IC5.2(VDD) IC5.13(VDDIO) R23.2
DGND: C36.1 C37.1 C38.2 IC5.9(GND) IC5.11(GND)
MMC_INT: IC5.15(INT) R23.1 ; port INT
SPI1_MISO: IC5.5(SPI_SDO) ; port SPI.MISO
SPI1_MOSI: IC5.16(SDA/SPI_SDI) ; port SPI.MOSI
SPI1_NSS: IC5.4(SPI_CS) ; port SPI.NSS
SPI1_SCK: IC5.1(SCL/SPI_SCK) ; port SPI.SCK
NetC38_1: C38.1 IC5.10(CAP)

Not connected (* = marked no-connect by the designer): IC5 3(NC)* 6(NC)* 7(NC)* 8(NC)* 12(NC)* 14(NC)*

### Notes on the sheet
- Shadab Mizan

### Library data of the parts
C36 = CL10A105KB8NNNC: as C4 on sheet STM32H745; LCSC Part #: C15849; Manu Part #: CL10A105KB8NNNC
C37 = CC0603KRX7R9BB104: as C2 on sheet TopLevel; LCSC Part #: C14663; Manu Part #: CC0603KRX7R9BB104
C38 = CL10A106KP8NNNC: 10uF ±10% 10V Ceramic Capacitor X5R 0603; LCSC Part #: C19702; Manu Part #: CL10A106KP8NNNC
IC5 = MMC5983MA: ±8 Gauss, High Performance 3-axis Magnetic Sensor; Manu Part #: MMC5983MA; LCSC Part #: C404329
R23 = 0603WAF1002T5E: as R3 on sheet STM32H745; LCSC Part #: C25804; Manu Part #: 0603WAF1002T5E

## Sheet SD Card.SchDoc
size A; SheetNumber: 3; SheetTotal: 14
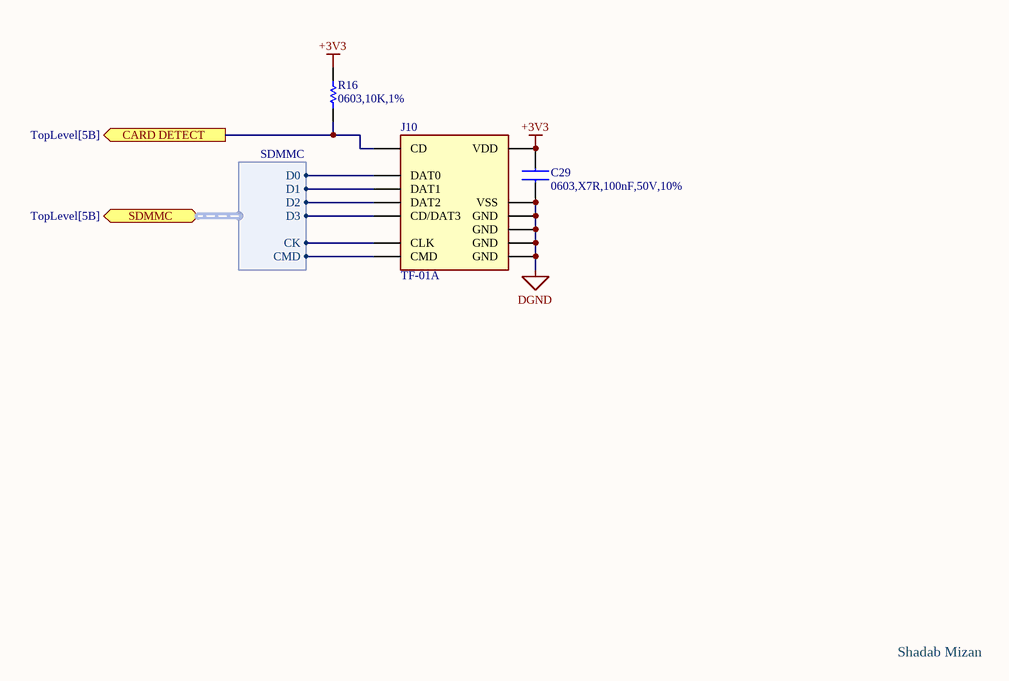
[diagram p4: SD Card.SchDoc]

### Parts
C29  0603,X7R,100nF,50V,10%  [CAPC1608X90N]
J10  TF-01A  [TF-SMD_TF-01A]
R16  0603,10K,1%  [RESC1608X90N]

### Ports
CARD DETECT (out, see TopLevel[5B]), SDMMC (bidir, harness SDMMC, see TopLevel[5B])

### Harnesses
SDMMC: CK, CMD, D0, D1, D2, D3

### Nets
+3V3: C29.2 J10.4(VDD) R16.2
DGND: C29.1 J10.6(VSS) J10.10(GND) J10.11(GND) J10.12(GND) J10.13(GND)
SD_CARD_DETECT: J10.9(CD) R16.1 ; port CARD DETECT
SDMMC1_CK: J10.5(CLK) ; port SDMMC.CK
SDMMC1_CMD: J10.3(CMD) ; port SDMMC.CMD
SDMMC1_D0: J10.7(DAT0) ; port SDMMC.D0
SDMMC1_D1: J10.8(DAT1) ; port SDMMC.D1
SDMMC1_D2: J10.1(DAT2) ; port SDMMC.D2
SDMMC1_D3: J10.2(CD/DAT3) ; port SDMMC.D3

### Notes on the sheet
- Shadab Mizan

### Library data of the parts
C29 = CC0603KRX7R9BB104: as C2 on sheet TopLevel; LCSC Part #: C14663; Manu Part #: CC0603KRX7R9BB104
J10 = TF-01A: Micro SD card (TF card) Connector and Ejector Push-Push Surface Mount; Manu Part #: TF-01A; LCSC Part #: C41426929
R16 = 0603WAF1002T5E: as R3 on sheet STM32H745; LCSC Part #: C25804; Manu Part #: 0603WAF1002T5E

## Sheet ICM40609.SchDoc
size A; SheetNumber: 6; SheetTotal: 14
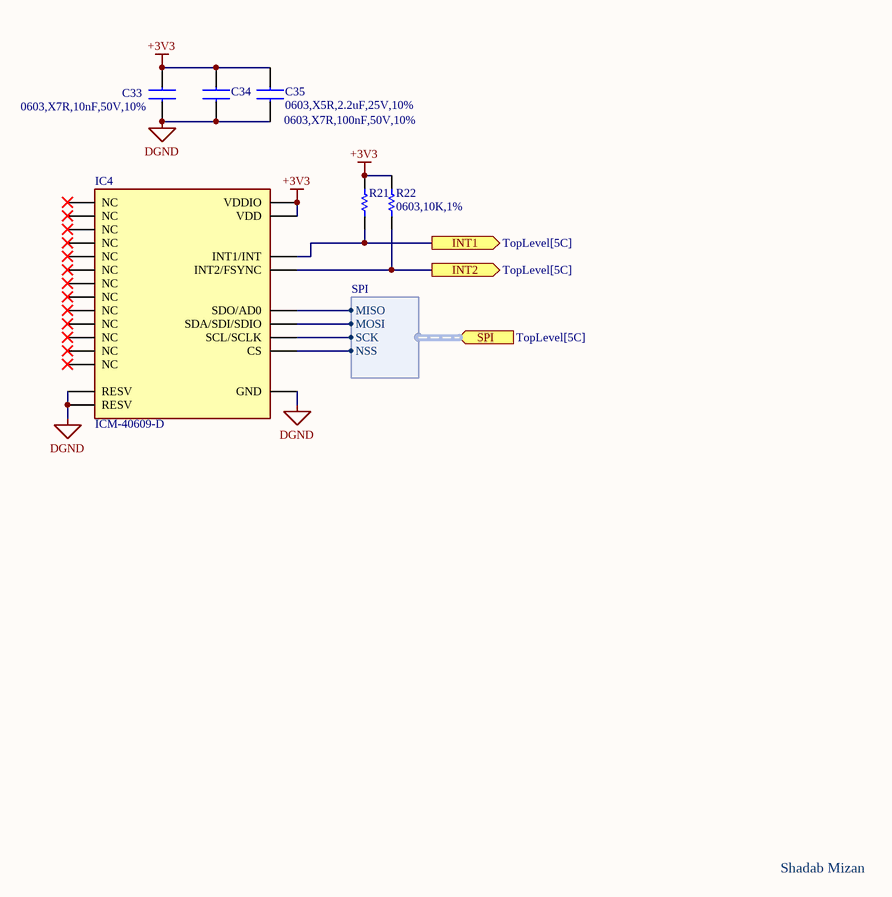
[diagram p5: ICM40609.SchDoc]

### Parts
C33  0603,X7R,10nF,50V,10%  [CAPC1608X90N]
C34  0603,X7R,100nF,50V,10%  [CAPC1608X90N]
C35  0603,X5R,2.2uF,25V,10%  [CAPC1608X90N]
IC4  ICM-40609-D  [LGA-24_L3.0-W3.0-P0.40-TL]
R21  0603,10K,1%  [RESC1608X90N]  (value not drawn)
R22  0603,10K,1%  [RESC1608X90N]

### Ports
INT1 (out, see TopLevel[5C]), INT2 (out, see TopLevel[5C]), SPI (in, harness SPI, see TopLevel[5C])

### Harnesses
SPI: NSS, SCK, MISO, MOSI

### Nets
+3V3: C33.2 C34.2 C35.2 IC4.8(VDDIO) IC4.13(VDD) R21.2 R22.2
DGND: C33.1 C34.1 C35.1 IC4.11(RESV) IC4.18(GND) IC4.20(RESV)
ICM_INT1: IC4.12(INT1/INT) R21.1 ; port INT1
ICM_INT2: IC4.19(INT2/FSYNC) R22.1 ; port INT2
SPI3_MISO: IC4.9(SDO/AD0) ; port SPI.MISO
SPI3_MOSI: IC4.24(SDA/SDI/SDIO) ; port SPI.MOSI
SPI3_NSS: IC4.22(CS) ; port SPI.NSS
SPI3_SCK: IC4.23(SCL/SCLK) ; port SPI.SCK

Not connected (* = marked no-connect by the designer): IC4 1(NC)* 2(NC)* 3(NC)* 4(NC)* 5(NC)* 6(NC)* 7(NC)* 10(NC)* 14(NC)* 15(NC)* 16(NC)* 17(NC)* 21(NC)*

### Notes on the sheet
- Shadab Mizan

### Library data of the parts
C33 = 0603B103K500NT: 10nF ±10% 50V Ceramic Capacitor X7R 0603; LCSC Part #: C57112; Manu Part #: 0603B103K500NT
C34 = CC0603KRX7R9BB104: as C2 on sheet TopLevel; LCSC Part #: C14663; Manu Part #: CC0603KRX7R9BB104
C35 = CL10A225KO8NNNC: as C19 on sheet STM32H745; Manu Part #: CL10A225KO8NNNC; LCSC Part #: C23630
IC4 = ICM-40609-D: LGA24-3x3 IMUs (Inertial Measurement Units) RoHS; Manu Part #: ICM-40609-D; LCSC Part #: C5360621
R21 R22 = 0603WAF1002T5E: as R3 on sheet STM32H745; LCSC Part #: C25804; Manu Part #: 0603WAF1002T5E

## Sheet MS5611.SchDoc
size A; SheetNumber: 5; SheetTotal: 12
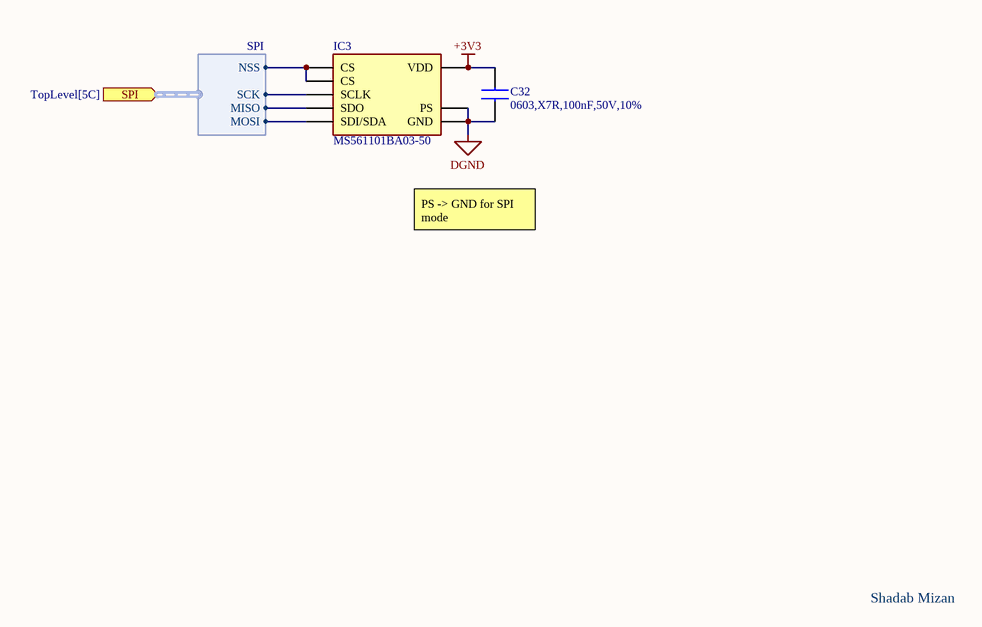
[diagram p6: MS5611.SchDoc]

### Parts
C32  0603,X7R,100nF,50V,10%  [CAPC1608X90N]
IC3  MS561101BA03-50  [MSI-MS561101BA03-50-8_V]

### Ports
SPI (in, harness SPI, see TopLevel[5C])

### Harnesses
SPI: NSS, SCK, MISO, MOSI

### Nets
+3V3: C32.2 IC3.1(VDD)
DGND: C32.1 IC3.2(PS) IC3.3(GND)
SPI2_MISO: IC3.6(SDO) ; port SPI.MISO
SPI2_MOSI: IC3.7(SDI/SDA) ; port SPI.MOSI
SPI2_NSS: IC3.4(CS) IC3.5(CS) ; port SPI.NSS
SPI2_SCK: IC3.8(SCLK) ; port SPI.SCK

### Notes on the sheet
- PS -> GND for SPI mode
- Shadab Mizan

### Library data of the parts
C32 = CC0603KRX7R9BB104: as C2 on sheet TopLevel; LCSC Part #: C14663; Manu Part #: CC0603KRX7R9BB104
IC3 = MS561101BA03-50: Barometric Pressure Sensor, with Stainless Steel Cap, 1.8 to 3.6 V, -45 to 85 degC, 8-Pin QFN, RoHS, Tape and Reel; Manu Part #: MS561101BA03-50; LCSC Part #: C15639

## Sheet MAX M10S.SchDoc
size A; SheetNumber: 9; SheetTotal: 14
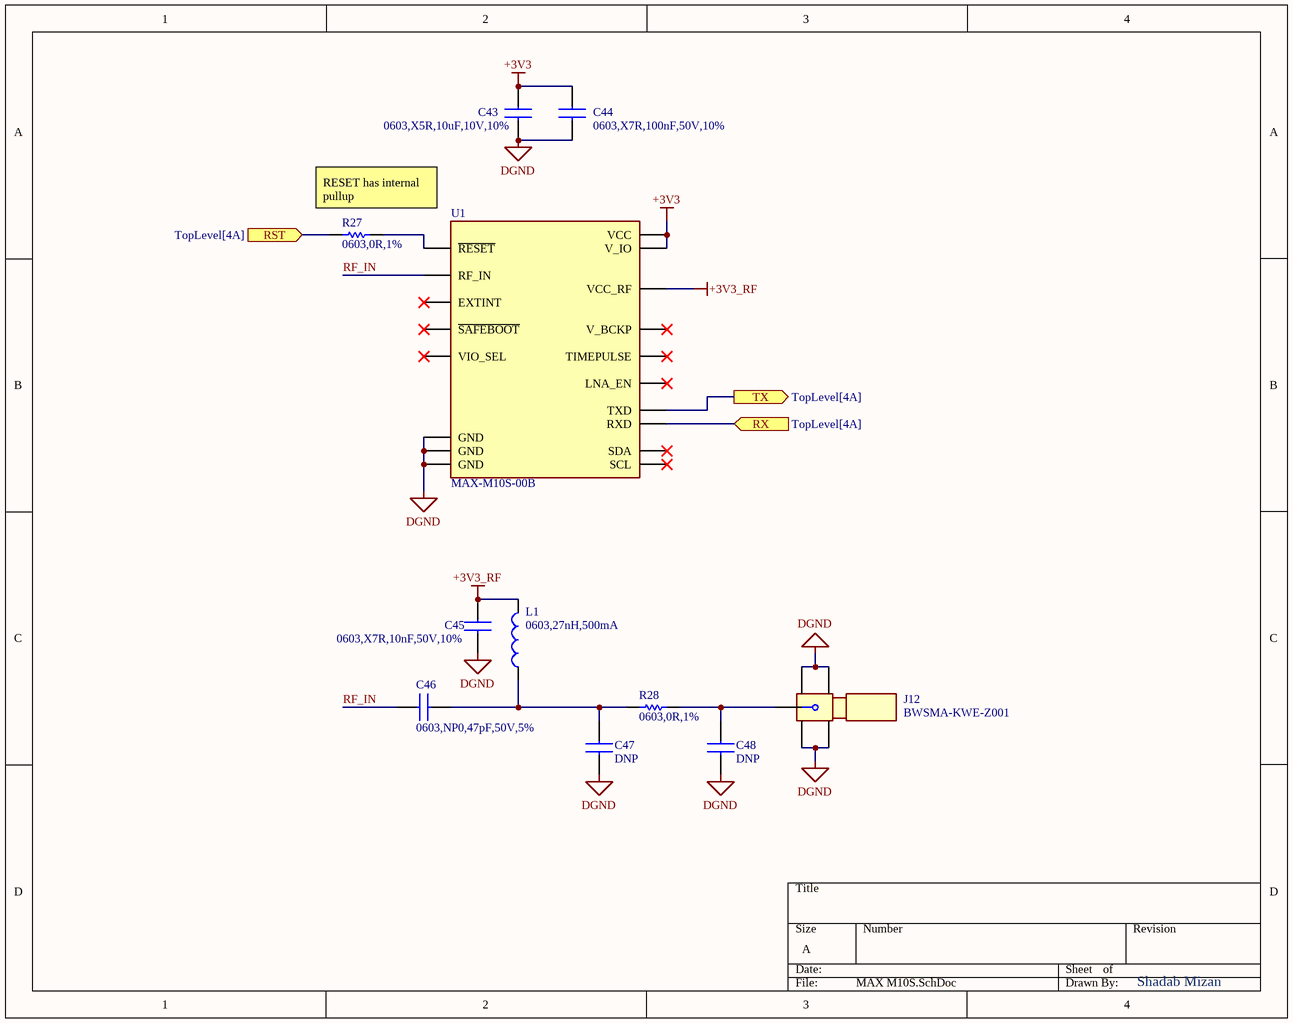
[diagram p7: MAX M10S.SchDoc]

### Parts
C43  0603,X5R,10uF,10V,10%  [CAPC1608X90N]
C44  0603,X7R,100nF,50V,10%  [CAPC1608X90N]
C45  0603,X7R,10nF,50V,10%  [CAPC1608X90N]
C46  0603,NP0,47pF,50V,5%  [CAPC1608X90N]
C47  DNP  [CAPC1608X90N]
C48  DNP  [CAPC1608X90N]
J12  BWSMA-KWE-Z001  [SMA-TH_BWSMA-KWE-Z001]
L1  0603,27nH,500mA  [INDC1608X90N]
R27  0603,0R,1%  [RESC1608X90N]
R28  0603,0R,1%  [RESC1608X90N]
U1  MAX-M10S-00B  [XCVR_MAX-M10S-00B]

### Ports
RST (in, see TopLevel[4A]), RX (in, see TopLevel[4A]), TX (out, see TopLevel[4A])

### Nets
+3V3: C43.2 C44.2 U1.7(V_IO) U1.8(VCC)
+3V3_RF: C45.2 L1.2 U1.14(VCC_RF)
DGND: C43.1 C44.1 C45.1 C47.1 C48.1 J12.1 J12.2 J12.3 J12.4 U1.1(GND) U1.10(GND) U1.12(GND)
GNSS RST: R27.1 ; port RST
GNSS RX: U1.3(RXD) ; port RX
GNSS TX: U1.2(TXD) ; port TX
RF_IN: C46.1 U1.11(RF_IN)
NetC46_2: C46.2 C47.2 L1.1 R28.1
NetC48_2: C48.2 J12.5 R28.2
NetR27_2: R27.2 U1.9(~{RESET})

Not connected (* = marked no-connect by the designer): U1 4(TIMEPULSE)* 5(EXTINT)* 6(V_BCKP)* 13(LNA_EN)* 15(VIO_SEL)* 16(SDA)* 17(SCL)* 18(~{SAFEBOOT})*

### Notes on the sheet
- RESET has internal pullup
- Shadab Mizan

### Library data of the parts
C43 = CL10A106KP8NNNC: 10uF ±10% 10V Ceramic Capacitor X5R 0603; LCSC Part #: C19702; Manu Part #: CL10A106KP8NNNC
C44 = CC0603KRX7R9BB104: as C2 on sheet TopLevel; LCSC Part #: C14663; Manu Part #: CC0603KRX7R9BB104
C45 = 0603B103K500NT: 10nF ±10% 50V Ceramic Capacitor X7R 0603; LCSC Part #: C57112; Manu Part #: 0603B103K500NT
C46 = CL10C470JB8NNNC: 47 pF ±5% 50V Ceramic Capacitor C0G, NP0 0603 (1608 Metric); Manu Part #: CL10C470JB8NNNC; LCSC Part #: C1671
C47 C48 = CC0603KRX7R9BB103: 10nF ±10% 50V Ceramic Capacitor X7R 0603; LCSC Part #: C100042; Manu Part #: CC0603KRX7R9BB103
J12 = BWSMA-KWE-Z001: Connector Receptacle SMA Female Pin 50Ω Through Hole Right Angle; Manu Part #: BWSMA-KWE-Z001; LCSC Part #: C496551
L1 = LQG18HN27NJ00D: 27 nH Unshielded Multilayer Inductor 500 mA 550mOhm Max 0603 (1608 Metric); Manu Part #: LQG18HN27NJ00D; LCSC Part #: C162550
R27 R28 = 0603WAF0000T5E: as R2 on sheet STM32H745; LCSC Part #: C21189; Manu Part #: 0603WAF0000T5E
U1 = MAX-M10S-00B: Standard precision GNSS module; Manu Part #: MAX-M10S-00B; LCSC Part #: C4153167

## Sheet USBC.SchDoc
size A; SheetNumber: 8; SheetTotal: 14
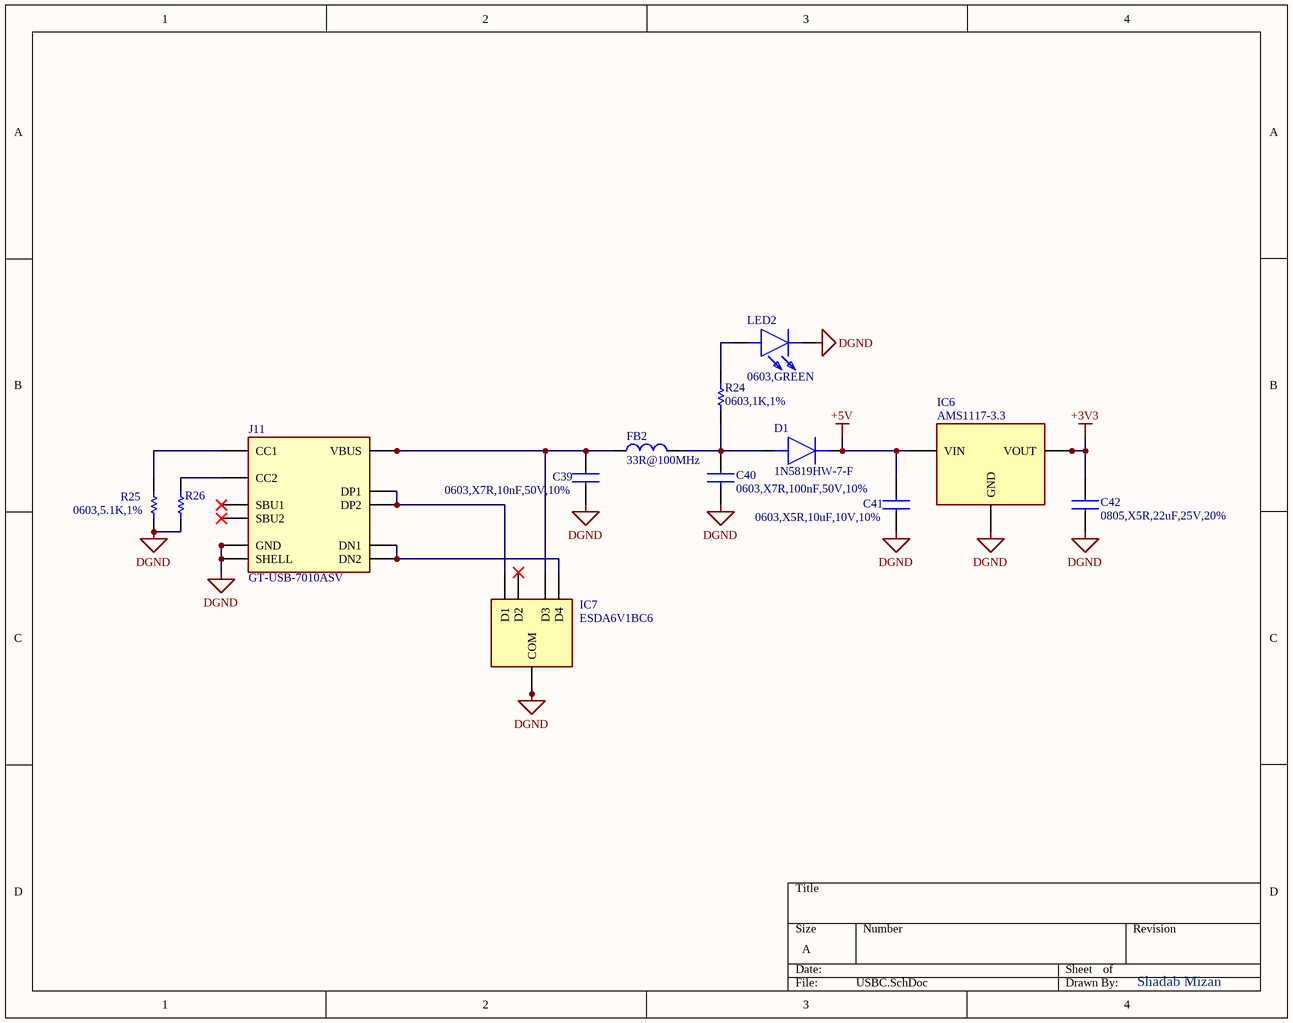
[diagram p8: USBC.SchDoc]

### Parts
C39  0603,X7R,10nF,50V,10%  [CAPC1608X90N]
C40  0603,X7R,100nF,50V,10%  [CAPC1608X90N]
C41  0603,X5R,10uF,10V,10%  [CAPC1608X90N]
C42  0805,X5R,22uF,25V,20%  [CAPC2012X145N]
D1  1N5819HW-7-F  [SOD3716X125N]
FB2  33R@100MHz  [BLM18SP221SN1B]
IC6  AMS1117-3.3  [SOT230P700X180-4N]
IC7  ESDA6V1BC6  [SOT95P280X145-6N]
J11  GT-USB-7010ASV  [USB-C-SMD_G-SWITCH_GT-USB-7010ASV]
LED2  0603,GREEN  [LEDC1608X36N]
R24  0603,1K,1%  [RESC1608X90N]
R25  0603,5.1K,1%  [RESC1608X55N]
R26  0603,5.1K,1%  [RESC1608X55N]  (value not drawn)

### Nets
+3V3: C42.2 IC6.2(OUTPUT) IC6.4(VOUT)
+5V: C41.2 D1.1(K) IC6.3(VIN)
DGND: C39.1 C40.1 C41.1 C42.1 IC6.1(GND) IC7.2(COM) IC7.5(COM) J11.1(SHELL) J11.2(SHELL) J11.3(SHELL) J11.4(SHELL) J11.A1B12(GND) J11.B1A12(GND) LED2.1(K) R25.2 R26.2
NetC39_2: C39.2 FB2.1 IC7.4(D3) J11.A4B9(VBUS) J11.B4A9(VBUS)
NetC40_2: C40.2 D1.2(A) FB2.2 R24.1
NetIC7_1: IC7.1(D1) J11.A6(DP1) J11.B6(DP2)
NetIC7_6: IC7.6(D4) J11.A7(DN1) J11.B7(DN2)
NetJ11_A5: J11.A5(CC1) R25.1
NetJ11_B5: J11.B5(CC2) R26.1
NetLED2_2: LED2.2(A) R24.2

Not connected (* = marked no-connect by the designer): IC7 3(D2)*; J11 A8(SBU1)* B8(SBU2)*

### Notes on the sheet
- Shadab Mizan

### Library data of the parts
C39 = 0603B103K500NT: 10nF ±10% 50V Ceramic Capacitor X7R 0603; LCSC Part #: C57112; Manu Part #: 0603B103K500NT
C40 = CC0603KRX7R9BB104: as C2 on sheet TopLevel; LCSC Part #: C14663; Manu Part #: CC0603KRX7R9BB104
C41 = CL10A106KP8NNNC: 10uF ±10% 10V Ceramic Capacitor X5R 0603; LCSC Part #: C19702; Manu Part #: CL10A106KP8NNNC
C42 = CL21A226MAQNNNE: 22uF ±20% 25V Ceramic Capacitor X5R 0805; LCSC Part #: C45783; Manu Part #: CL21A226MAQNNNE
D1 = 1N5819HW-7-F: 25A 1 Independent 40V 450mV@1A 1A SOD-123 Single Diodes RoHS; Manu Part #: 1N5819HW-7-F; LCSC Part #: C82544
FB2 = BLM18SG330SN1D: 33Ω@100MHz 1 Line Ferrite Bead 0603 6A 8mΩ; Manu Part #: BLM18SG330SN1D; LCSC Part #: C576399
IC6 = AMS1117-3.3: 70dB@(120Hz) 1.35A Fixed 3.3V Positive 10V SOT-223 Voltage Regulators - Linear, Low Drop Out (LDO) Regulators ROHS; LCSC Part #: C6186; Manu Part #: AMS1117-3.3
IC7 = ESDA6V1BC6: Clamp Ipp Tvs Diode Surface Mount SOT-23-6; LCSC Part #: C495220; Manu Part #: ESDA6V1BC6
J11 = GT-USB-7010ASV: USB 2.0 3A 1 Surface Mount, Right Angle 16P Female -40℃~+85℃ Type-C SMD USB Connectors ROHS; LCSC Part #: C2988369; Manu Part #: GT-USB-7010ASV
LED2 = SML-E12P8WT86: Green LED Indication - Discrete 2.2V 0603; Manu Part #: SML-E12P8WT86; LCSC Part #: C126319
R24 = 0603WAF1001T5E: as R4 on sheet STM32H745; LCSC Part #: C21190; Manu Part #: 0603WAF1001T5E
R25 R26 = RC0603FR-075K1L: 100mW 5.1kΩ 75V Thick Film Resistor ±100ppm/℃ ±1% 0603 Chip Resistor - Surface Mount RoHS; LCSC Part #: C105580; Manu Part #: RC0603FR-075K1L

## Sheet BMI088.SchDoc
size A; SheetNumber: 4; SheetTotal: 14
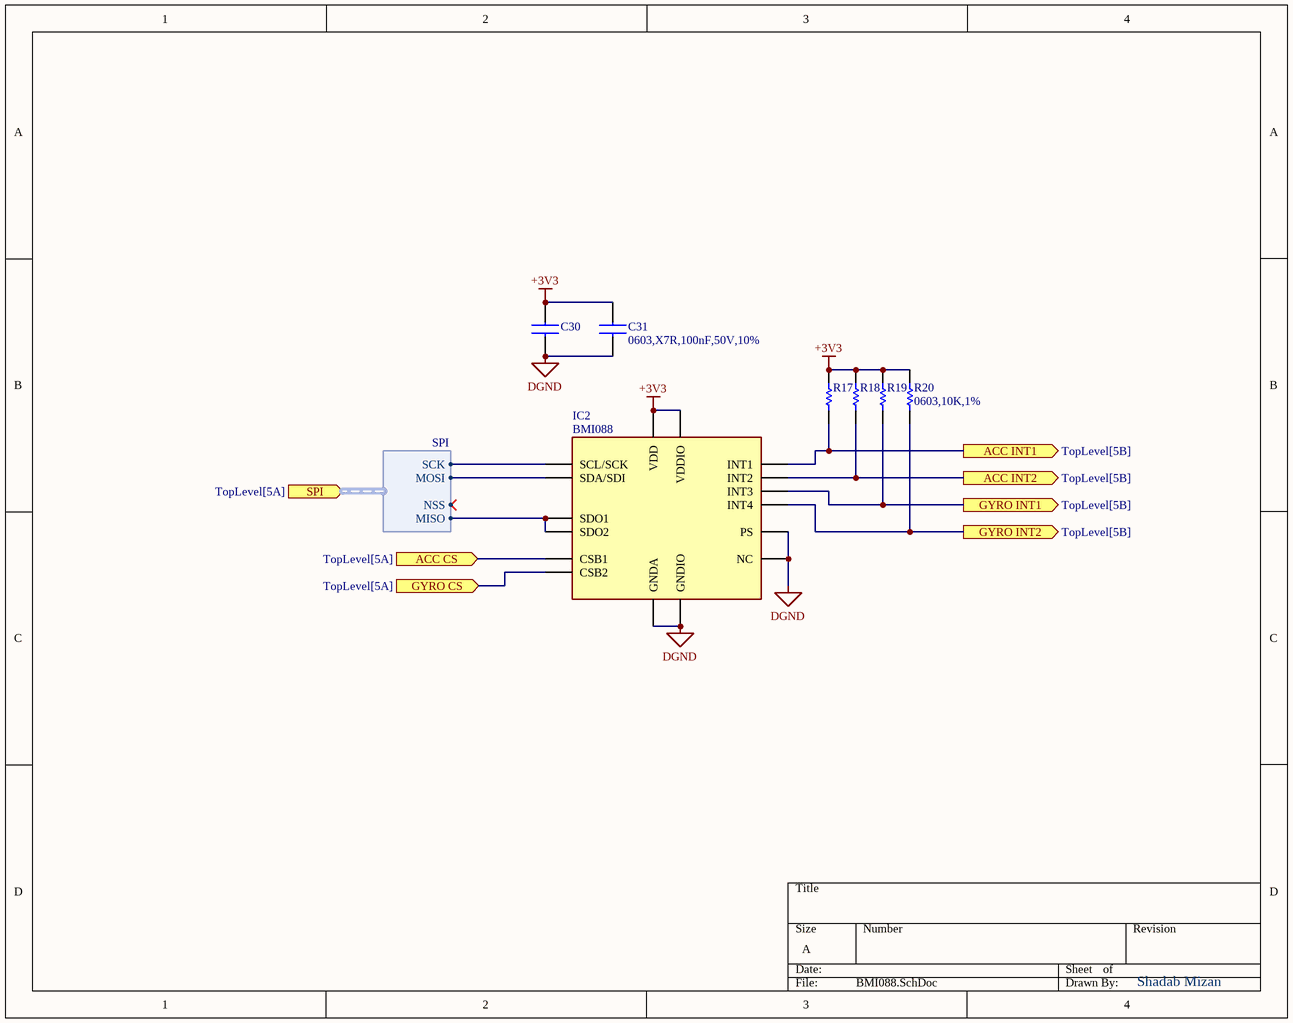
[diagram p9: BMI088.SchDoc]

### Parts
C30  0603,X7R,100nF,50V,10%  [CAPC1608X90N]  (value not drawn)
C31  0603,X7R,100nF,50V,10%  [CAPC1608X90N]
IC2  BMI088  [BMI088]
R17  0603,10K,1%  [RESC1608X90N]  (value not drawn)
R18  0603,10K,1%  [RESC1608X90N]  (value not drawn)
R19  0603,10K,1%  [RESC1608X90N]  (value not drawn)
R20  0603,10K,1%  [RESC1608X90N]

### Ports
ACC CS (in, see TopLevel[5A]), ACC INT1 (out, see TopLevel[5B]), ACC INT2 (out, see TopLevel[5B]), GYRO CS (in, see TopLevel[5A]), GYRO INT1 (out, see TopLevel[5B]), GYRO INT2 (out, see TopLevel[5B]), SPI (in, harness SPI, see TopLevel[5A])

### Harnesses
SPI: NSS, SCK, MISO, MOSI

### Nets
+3V3: C30.2 C31.2 IC2.3(VDD) IC2.11(VDDIO) R17.2 R18.2 R19.2 R20.2
DGND: C30.1 C31.1 IC2.2(NC) IC2.4(GNDA) IC2.6(GNDIO) IC2.7(PS)
BMI_ACC_CS: IC2.14(CSB1) ; port ACC CS
BMI_ACC_INT1: IC2.16(INT1) R17.1 ; port ACC INT1
BMI_ACC_INT2: IC2.1(INT2) R18.1 ; port ACC INT2
BMI_GYRO_CS: IC2.5(CSB2) ; port GYRO CS
BMI_GYRO_INT1: IC2.12(INT3) R19.1 ; port GYRO INT1
BMI_GYRO_INT2: IC2.13(INT4) R20.1 ; port GYRO INT2
SPI4_MISO: IC2.10(SDO2) IC2.15(SDO1) ; port SPI.MISO
SPI4_MOSI: IC2.9(SDA/SDI) ; port SPI.MOSI
SPI4_SCK: IC2.8(SCL/SCK) ; port SPI.SCK

### Notes on the sheet
- Shadab Mizan

### Library data of the parts
C30 C31 = CC0603KRX7R9BB104: as C2 on sheet TopLevel; LCSC Part #: C14663; Manu Part #: CC0603KRX7R9BB104
IC2 = BMI088: Inertial Measurement Unit IMU 6-Axis LGA; LCSC Part #: C194919; Manu Part #: BMI088
R17-R20 = 0603WAF1002T5E: as R3 on sheet STM32H745; LCSC Part #: C25804; Manu Part #: 0603WAF1002T5E

## Sheet Debug.SchDoc
size A; SheetNumber: 10; SheetTotal: 14
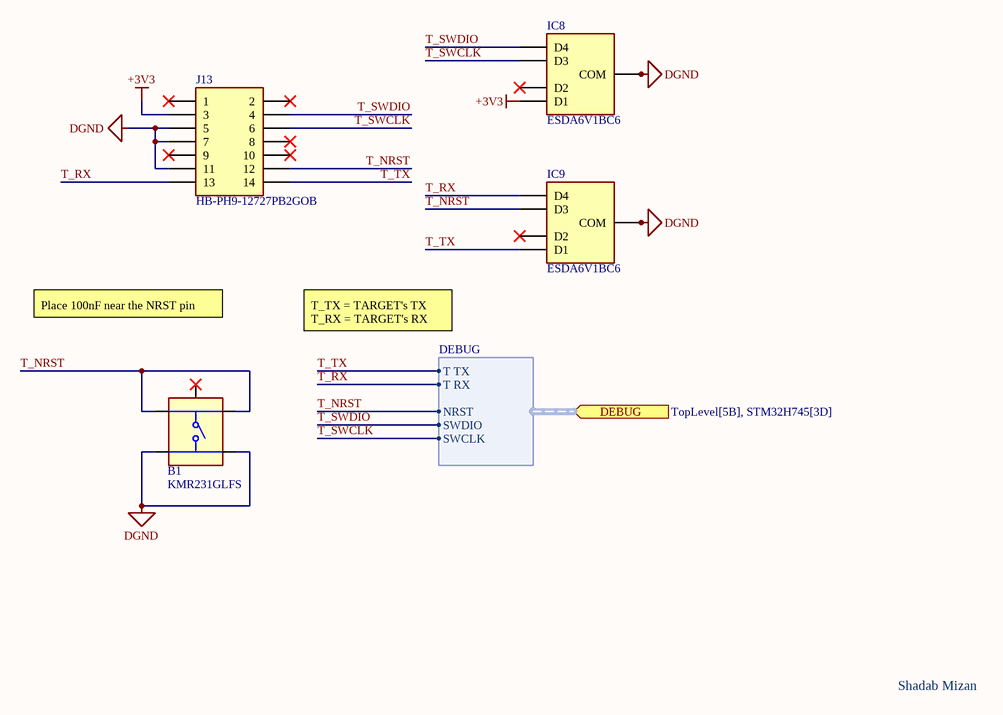
[diagram p10: Debug.SchDoc]

### Parts
B1  KMR231GLFS  [KMR231GLFS]
IC8  ESDA6V1BC6  [SOT95P280X145-6N]
IC9  ESDA6V1BC6  [SOT95P280X145-6N]
J13  HB-PH9-12727PB2GOB  [HB-PH9-12727PB2GOB]

### Ports
DEBUG (in, harness DEBUG, see TopLevel[5B], STM32H745[3D])

### Harnesses
DEBUG: T TX, T RX, NRST, SWDIO, SWCLK

### Nets
+3V3: IC8.1(D1) J13.3
DGND: B1.3 B1.4 IC8.2(COM) IC8.5(COM) IC9.2(COM) IC9.5(COM) J13.5 J13.7 J13.11
T_NRST: B1.1 B1.2 IC9.4(D3) J13.12 ; port DEBUG.NRST  [project net NRST]
T_RX: IC9.6(D4) J13.13 ; port DEBUG.T RX  [project net LPUART1_RX]
T_SWCLK: IC8.4(D3) J13.6 ; port DEBUG.SWCLK  [project net DEBUG_SWCLK]
T_SWDIO: IC8.6(D4) J13.4 ; port DEBUG.SWDIO  [project net DEBUG_SWDIO]
T_TX: IC9.1(D1) J13.14 ; port DEBUG.T TX  [project net LPUART1_TX]

Not connected (* = marked no-connect by the designer): B1 5*; IC8 3(D2)*; IC9 3(D2)*; J13 1* 2* 8* 9* 10*

### Notes on the sheet
- Place 100nF near the NRST pin
- T_TX = TARGET's TX
  T_RX = TARGET's RX
- Shadab Mizan

### Library data of the parts
B1 = KMR231GLFS: Tactile Switch SPST 300gf 1.9mm Gull Wing 4.6mm x 2.8mm Surface Mount; LCSC Part #: C99271; Manu Part #: KMR231GLFS
IC8 IC9 = ESDA6V1BC6: as IC7 on sheet USBC; LCSC Part #: C495220; Manu Part #: ESDA6V1BC6
J13 = HB-PH9-12727PB2GOB: Pin Header 2 1mm 4mm 14P -40℃~+105℃ 1.27mm 1A 250V 2x7P 1.27mm SMD,P=1.27mm Headers, Male Pins RoHS; LCSC Part #: C6332251; Manu Part #: HB-PH9-12727PB2GOB

## Sheet Ethernet Phy.SchDoc
size B; SheetNumber: 11; SheetTotal: 14
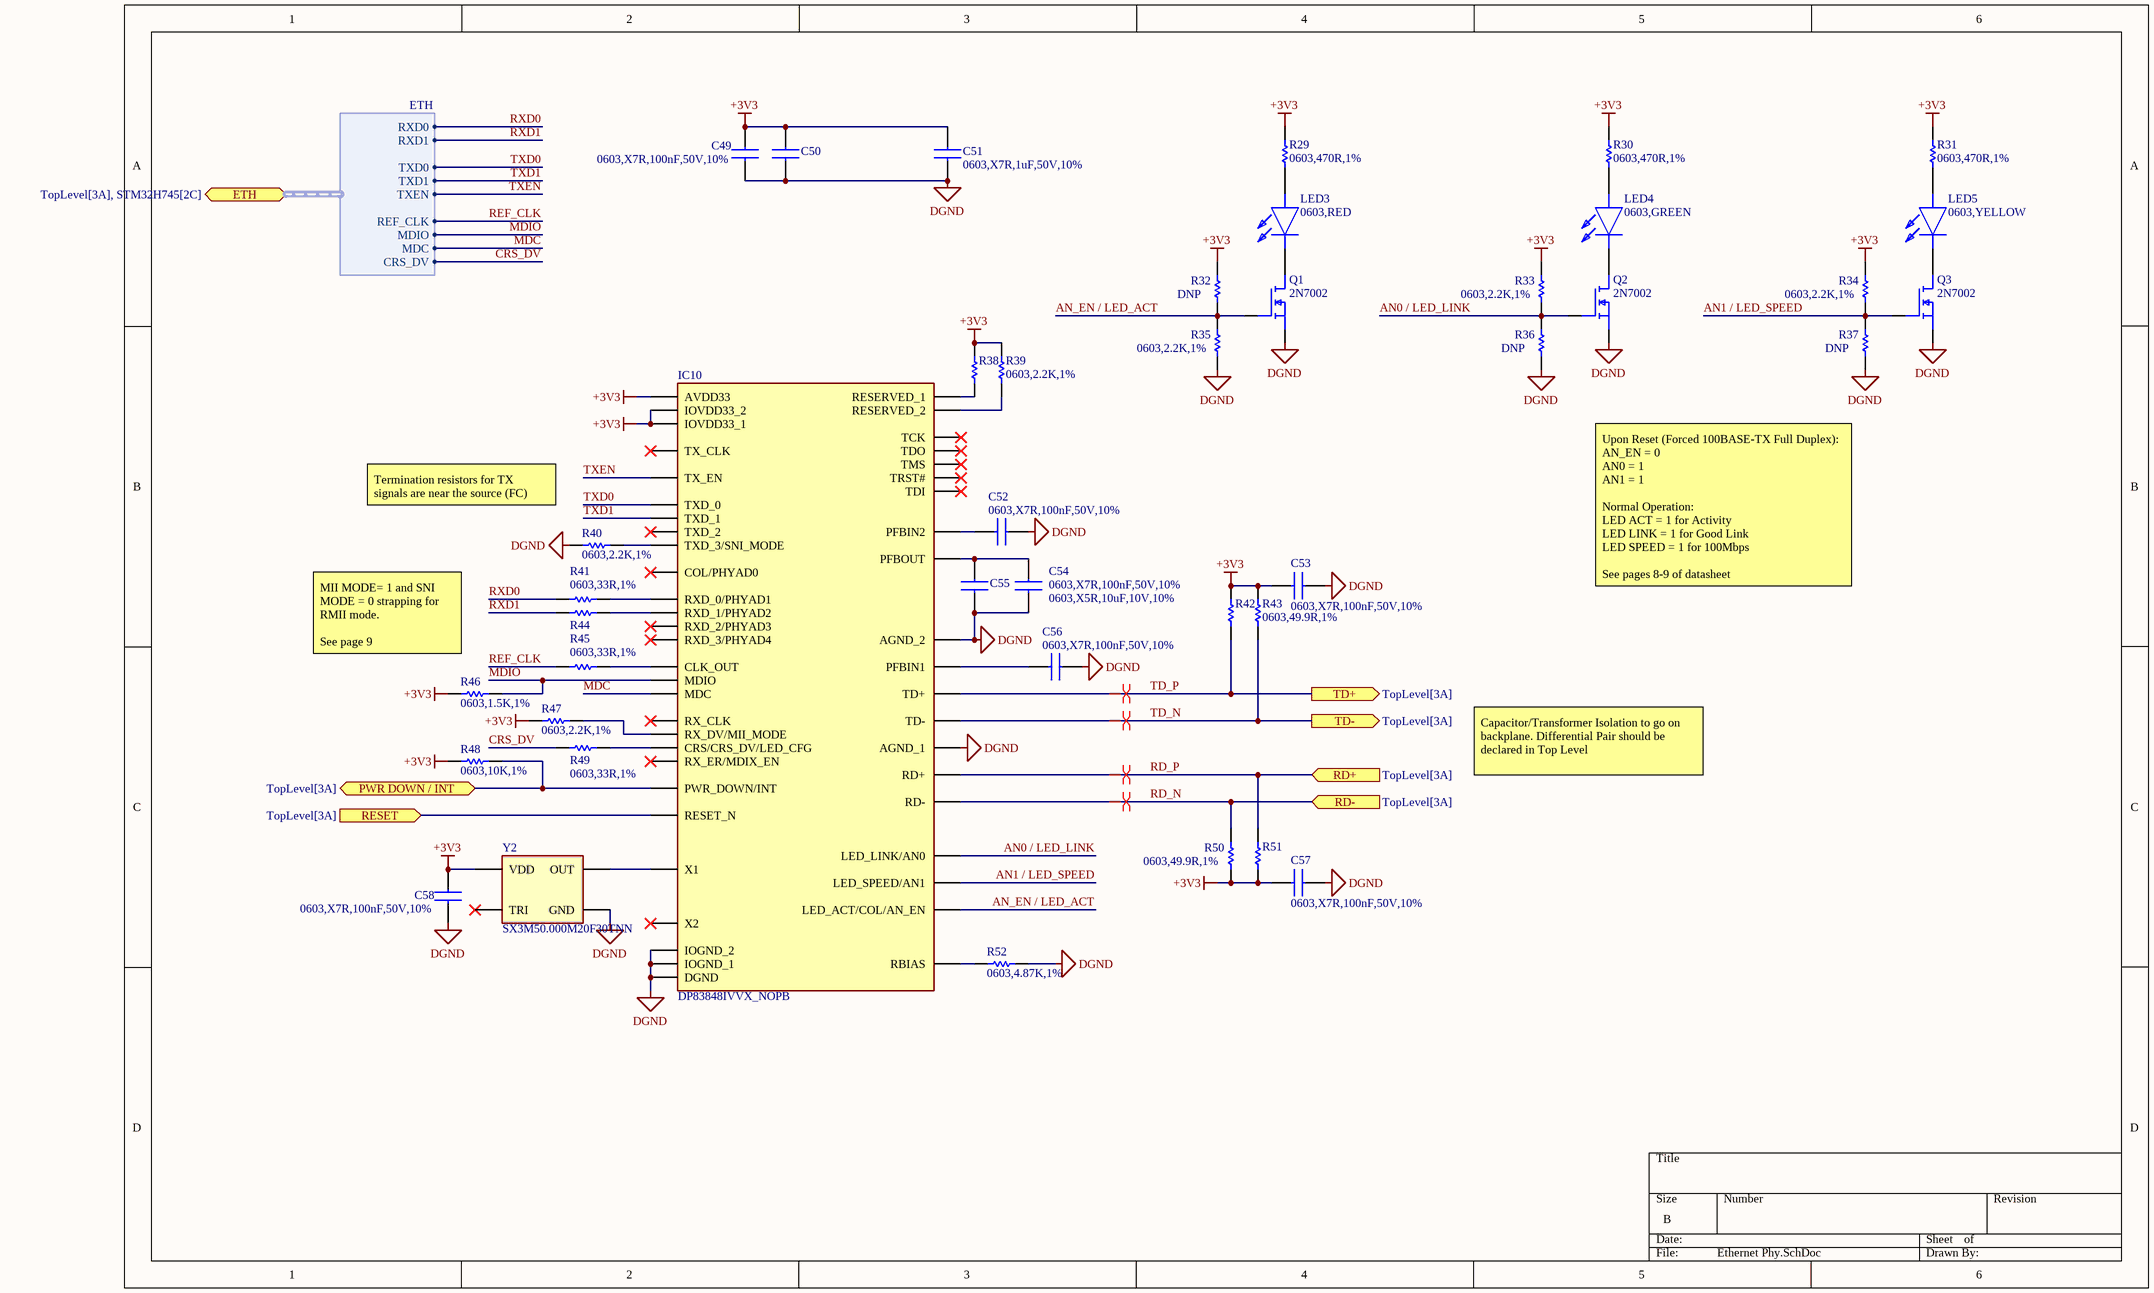
[diagram p11: Ethernet Phy.SchDoc]

### Parts
C49  0603,X7R,100nF,50V,10%  [CAPC1608X90N]
C50  0603,X7R,100nF,50V,10%  [CAPC1608X90N]  (value not drawn)
C51  0603,X7R,1uF,50V,10%  [CAPC1608X90N]
C52  0603,X7R,100nF,50V,10%  [CAPC1608X90N]
C53  0603,X7R,100nF,50V,10%  [CAPC1608X90N]
C54  0603,X7R,100nF,50V,10%  [CAPC1608X90N]
C55  0603,X5R,10uF,10V,10%  [CAPC1608X90N]
C56  0603,X7R,100nF,50V,10%  [CAPC1608X90N]
C57  0603,X7R,100nF,50V,10%  [CAPC1608X90N]
C58  0603,X7R,100nF,50V,10%  [CAPC1608X90N]
IC10  DP83848IVVX_NOPB  [QFP50P900X900X160-48N]
LED3  0603,RED  [LEDC1608X36N]
LED4  0603,GREEN  [LEDC1608X36N]
LED5  0603,YELLOW  [LEDC1608X36N]
Q1  2N7002  [SOT95P230X110-3N]
Q2  2N7002  [SOT95P230X110-3N]
Q3  2N7002  [SOT95P230X110-3N]
R29  0603,470R,1%  [RESC1608X90N]
R30  0603,470R,1%  [RESC1608X90N]
R31  0603,470R,1%  [RESC1608X90N]
R32  DNP  [RESC1608X90N]
R33  0603,2.2K,1%  [RESC1608X90N]
R34  0603,2.2K,1%  [RESC1608X90N]
R35  0603,2.2K,1%  [RESC1608X90N]
R36  DNP  [RESC1608X90N]
R37  DNP  [RESC1608X90N]
R38  0603,2.2K,1%  [RESC1608X90N]  (value not drawn)
R39  0603,2.2K,1%  [RESC1608X90N]
R40  0603,2.2K,1%  [RESC1608X90N]
R41  0603,33R,1%  [RESC1608X90N]
R42  0603,49.9R,1%  [RESC1608X90N]  (value not drawn)
R43  0603,49.9R,1%  [RESC1608X90N]
R44  0603,33R,1%  [RESC1608X90N]  (value not drawn)
R45  0603,33R,1%  [RESC1608X90N]
R46  0603,1.5K,1%  [RESC1608X90N]
R47  0603,2.2K,1%  [RESC1608X90N]
R48  0603,10K,1%  [RESC1608X90N]
R49  0603,33R,1%  [RESC1608X90N]
R50  0603,49.9R,1%  [RESC1608X90N]
R51  0603,49.9R,1%  [RESC1608X90N]  (value not drawn)
R52  0603,4.87K,1%  [RESC1608X55N]
Y2  SX3M50.000M20F30TNN  [SX3M50_000M20F30TNN]

### Ports
ETH (bidir, harness ETH, see TopLevel[3A], STM32H745[2C]), PWR DOWN / INT (bidir, see TopLevel[3A]), RD+ (in, see TopLevel[3A]), RD- (in, see TopLevel[3A]), RESET (in, see TopLevel[3A]), TD+ (out, see TopLevel[3A]), TD- (out, see TopLevel[3A])

### Harnesses
ETH: RXD0, RXD1, TXD0, TXD1, REF_CLK, MDIO, MDC, CRS_DV, TXEN

### Nets
+3V3: C49.2 C50.2 C51.2 C53.2 C57.2 C58.2 IC10.22(AVDD33) IC10.32(IOVDD33_1) IC10.48(IOVDD33_2) R29.2 R30.2 R31.2 R32.2 R33.2 R34.2 R38.2 R39.2 R42.2 R43.2 R46.1 R47.1 R48.1 R50.1 R51.1 Y2.4(VDD)
DGND: C49.1 C50.1 C51.1 C52.1 C53.1 C54.1 C55.1 C56.2 C57.1 C58.1 IC10.15(AGND_1) IC10.19(AGND_2) IC10.35(IOGND_1) IC10.36(DGND) IC10.47(IOGND_2) Q1.2(S) Q2.2(S) Q3.2(S) R35.1 R36.1 R37.1 R40.1 R52.2 Y2.2(GND)
AN0 / LED_LINK: IC10.28(LED_LINK/AN0) Q2.1(G) R33.1 R36.2
AN1 / LED_SPEED: IC10.27(LED_SPEED/AN1) Q3.1(G) R34.1 R37.2
AN_EN / LED_ACT: IC10.26(LED_ACT/COL/AN_EN) Q1.1(G) R32.1 R35.2
CRS_DV: R49.1 ; port ETH.CRS_DV
MDC: IC10.31(MDC) ; port ETH.MDC  [project net ETH_MDC]
MDIO: IC10.30(MDIO) R46.2 ; port ETH.MDIO  [project net ETH_MDIO]
PHY_INT: IC10.7(PWR_DOWN/INT) R48.2 ; port PWR DOWN / INT
PHY_RST: IC10.29(RESET_N) ; port RESET
RD_N: IC10.13(RD-) R50.2 ; port RD-  [project net FC ETH RD_N]
RD_P: IC10.14(RD+) R51.2 ; port RD+  [project net FC ETH RD_P]
REF_CLK: R45.1 ; port ETH.REF_CLK  [project net ETH_REF_CLK]
RXD0: R41.1 ; port ETH.RXD0  [project net ETH_RXD0]
RXD1: R44.1 ; port ETH.RXD1  [project net ETH_RXD1]
TD_N: IC10.16(TD-) R43.1 ; port TD-  [project net FC ETH TD_N]
TD_P: IC10.17(TD+) R42.1 ; port TD+  [project net FC ETH TD_P]
TXD0: IC10.3(TXD_0) ; port ETH.TXD0
TXD1: IC10.4(TXD_1) ; port ETH.TXD1
TXEN: IC10.2(TX_EN) ; port ETH.TXEN
NetC52_2: C52.2 IC10.37(PFBIN2)
NetC54_2: C54.2 C55.2 IC10.23(PFBOUT)
NetC56_1: C56.1 IC10.18(PFBIN1)
NetIC10_6: IC10.6(TXD_3/SNI_MODE) R40.2
NetIC10_20: IC10.20(RESERVED_1) R38.1
NetIC10_21: IC10.21(RESERVED_2) R39.1
NetIC10_24: IC10.24(RBIAS) R52.1
NetIC10_25: IC10.25(CLK_OUT) R45.2
NetIC10_34: IC10.34(X1) Y2.3(OUT)
NetIC10_39: IC10.39(RX_DV/MII_MODE) R47.2
NetIC10_40: IC10.40(CRS/CRS_DV/LED_CFG) R49.2
NetIC10_43: IC10.43(RXD_0/PHYAD1) R41.2
NetIC10_44: IC10.44(RXD_1/PHYAD2) R44.2
NetLED3_1: LED3.1(K) Q1.3(D)
NetLED3_2: LED3.2(A) R29.1
NetLED4_1: LED4.1(K) Q2.3(D)
NetLED4_2: LED4.2(A) R30.1
NetLED5_1: LED5.1(K) Q3.3(D)
NetLED5_2: LED5.2(A) R31.1

Not connected (* = marked no-connect by the designer): IC10 1(TX_CLK)* 5(TXD_2)* 8(TCK)* 9(TDO)* 10(TMS)* 11(TRST#)* 12(TDI)* 33(X2)* 38(RX_CLK)* 41(RX_ER/MDIX_EN)* 42(COL/PHYAD0)* 45(RXD_2/PHYAD3)* 46(RXD_3/PHYAD4)*; Y2 1(TRI)*

### Layout directives
differential pair: FC ETH RD_N, FC ETH RD_P, FC ETH TD_N, FC ETH TD_P

### Notes on the sheet
- (near R40) Termination resistors for TX signals are near the source (FC)
- Upon Reset (Forced 100BASE-TX Full Duplex):
  AN_EN = 0
  AN0 = 1
  AN1 = 1
  Normal Operation:
  LED ACT = 1 for Activity
  LED LINK = 1 for Good Link
  LED SPEED = 1 for 100Mbps
  See pages 8-9 of datasheet
- (near R46) MII MODE= 1 and SNI MODE = 0 strapping for RMII mode.
  See page 9
- Capacitor/Transformer Isolation to go on backplane. Differential Pair should be declared in Top Level

### Library data of the parts
C49 C50 C52-C54 C56-C58 = CC0603KRX7R9BB104: as C2 on sheet TopLevel; LCSC Part #: C14663; Manu Part #: CC0603KRX7R9BB104
C51 = CL10A105KB8NNNC: as C4 on sheet STM32H745; LCSC Part #: C15849; Manu Part #: CL10A105KB8NNNC
C55 = CL10A106KP8NNNC: 10uF ±10% 10V Ceramic Capacitor X5R 0603; LCSC Part #: C19702; Manu Part #: CL10A106KP8NNNC
IC10 = DP83848IVVX_NOPB: Single Port 10/100 Mb/s Ethernet Physical Layer Transceiver; Manu Part #: DP83848IVVX/NOPB; LCSC Part #: C12082
LED3 = KT-0603R: as LED1 on sheet TopLevel; Manu Part #: KT-0603R; LCSC Part #: C2286
LED4 = SML-E12P8WT86: as LED2 on sheet USBC; Manu Part #: SML-E12P8WT86; LCSC Part #: C126319
LED5 = SML-D12Y1WT86: Yellow LED Indication - Discrete 2.2V 0603; Manu Part #: SML-D12Y1WT86; LCSC Part #: C253534
Q1-Q3 = 2N7002: N-Channel 60V 300mA 830mW Surface Mount SOT-23; Manu Part #: 2N7002; LCSC Part #: C8545
R29-R31 = 0603WAF4700T5E: as R1 on sheet TopLevel; LCSC Part #: C23179; Manu Part #: 0603WAF4700T5E
R32-R40 R47 = 0603WAF2201T5E: 2.2kΩ ±1% 100mW 0603 Thick Film Resistor; LCSC Part #: C4190; Manu Part #: 0603WAF2201T5E
R41 R44 R45 R49 = 0603WAF330JT5E: as R5 on sheet STM32H745; LCSC Part #: C23140; Manu Part #: 0603WAF330JT5E
R42 R43 R50 R51 = 0603WAF499JT5E: -55℃~+155℃ 100mW 49.9Ω 75V Thick Film Resistor ±1% ±100ppm/℃ 0603 Chip Resistor - Surface Mount ROHS; LCSC Part #: C23185; Manu Part #: 0603WAF499JT5E
R46 = 0603WAF1501T5E: 100mW 1.5kΩ 75V Thick Film Resistor ±100ppm/℃ ±1% 0603 Chip Resistor - Surface Mount RoHS; LCSC Part #: C22843; Manu Part #: 0603WAF1501T5E
R48 = 0603WAF1002T5E: as R3 on sheet STM32H745; LCSC Part #: C25804; Manu Part #: 0603WAF1002T5E
R52 = RC0603FR-074K87L: 4.87kΩ 100mW 75V Thick Film Resistor ±100ppm/℃ ±1% 0603 Chip Resistor - Surface Mount RoHS; LCSC Part #: C137709; Manu Part #: RC0603FR-074K87L
Y2 = SX3M50.000M20F30TNN: Oscillator 50MHz ±20ppm CMOS 1.62V~3.63V SMD3225-4P; LCSC Part #: C2901592; Manu Part #: SX3M50.000M20F30TNN

## Sheet TTL.SchDoc
size A; SheetNumber: 12; SheetTotal: 14
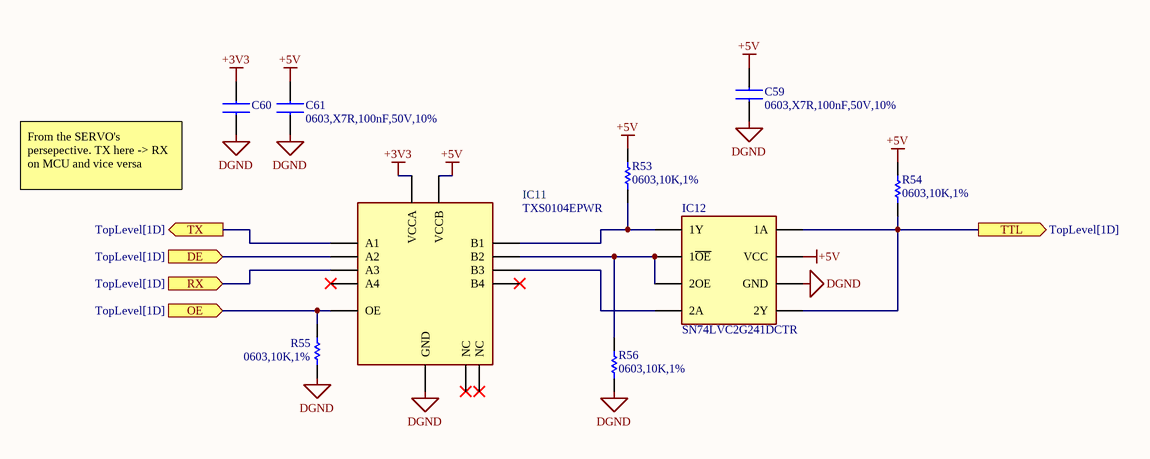
[diagram p12: TTL.SchDoc]

### Parts
C59  0603,X7R,100nF,50V,10%  [CAPC1608X90N]
C60  0603,X7R,100nF,50V,10%  [CAPC1608X90N]  (value not drawn)
C61  0603,X7R,100nF,50V,10%  [CAPC1608X90N]
IC11  TXS0104EPWR  [TXB0104PWR]
IC12  SN74LVC2G241DCTR  [SOP65P400X130-8N]
R53  0603,10K,1%  [RESC1608X90N]
R54  0603,10K,1%  [RESC1608X90N]
R55  0603,10K,1%  [RESC1608X90N]
R56  0603,10K,1%  [RESC1608X90N]

### Ports
DE (in, see TopLevel[1D]), OE (in, see TopLevel[1D]), RX (in, see TopLevel[1D]), TTL (out, see TopLevel[1D]), TX (out, see TopLevel[1D])

### Nets
+3V3: C60.2 IC11.1(VCCA)
+5V: C59.2 C61.2 IC11.14(VCCB) IC12.8(VCC) R53.2 R54.2
DGND: C59.1 C60.1 C61.1 IC11.7(GND) IC12.4(GND) R55.1 R56.1
LVL SHIFT OE: IC11.8(OE) R55.2 ; port OE
SERVO DE: IC11.3(A2) ; port DE
SERVO RX: IC11.4(A3) ; port RX
SERVO TX: IC11.2(A1) ; port TX
NetIC11_11: IC11.11(B3) IC12.5(2A)
NetIC11_12: IC11.12(B2) IC12.1(1~{OE}) IC12.7(2OE) R56.2
NetIC11_13: IC11.13(B1) IC12.6(1Y) R53.1
NetIC12_2: IC12.2(1A) IC12.3(2Y) R54.1 ; port TTL

Not connected (* = marked no-connect by the designer): IC11 5(A4)* 6(NC)* 9(NC)* 10(B4)*

### Notes on the sheet
- From the SERVO's persepective. TX here -> RX on MCU and vice versa

### Library data of the parts
C59-C61 = CC0603KRX7R9BB104: as C2 on sheet TopLevel; LCSC Part #: C14663; Manu Part #: CC0603KRX7R9BB104
IC11 = TXS0104EPWR: 4-Bit Bidirectional Voltage-Level Translator For Open-Drain and Push-Pull Applications; LCSC Part #: C44955; Manu Part #: TXS0104EPWR
IC12 = SN74LVC2G241DCTR: SN74LVC2G241 Dual Buffer and Driver with Three-State Outputs; Manu Part #: SN74LVC2G241DCTR; LCSC Part #: C2676069
R53-R56 = 0603WAF1002T5E: as R3 on sheet STM32H745; LCSC Part #: C25804; Manu Part #: 0603WAF1002T5E

## Sheet Power.SchDoc
size A4; SheetNumber: 13; SheetTotal: 14
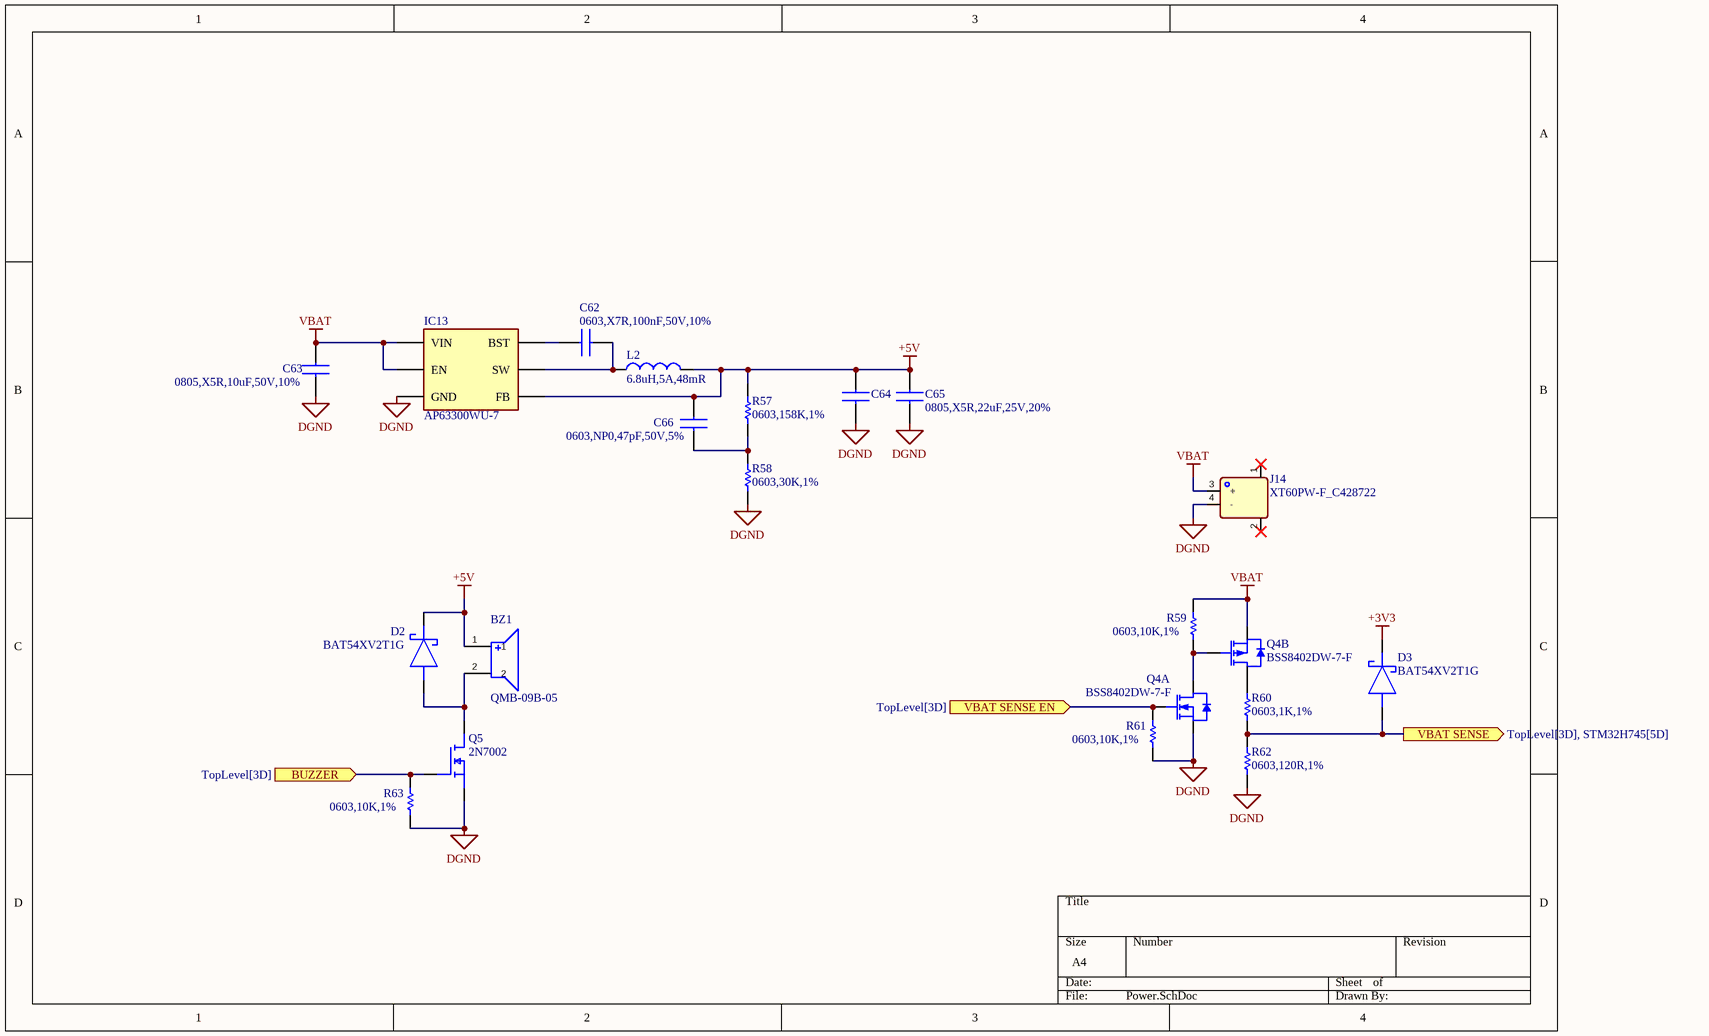
[diagram p13: Power.SchDoc]

### Parts
BZ1  QMB-09B-05  [QMB-09B-05]
C62  0603,X7R,100nF,50V,10%  [CAPC1608X90N]
C63  0805,X5R,10uF,50V,10%  [CAPC2012X145N]
C64  0805,X5R,22uF,25V,20%  [CAPC2012X145N]  (value not drawn)
C65  0805,X5R,22uF,25V,20%  [CAPC2012X145N]
C66  0603,NP0,47pF,50V,5%  [CAPC1608X90N]
D2  BAT54XV2T1G  [SOD523]
D3  BAT54XV2T1G  [SOD523]
IC13  AP63300WU-7  [SOT95P280X90-6N]
J14  XT60PW-F_C428722  [XT60PW-F_C428722]
L2  6.8uH,5A,48mR  [FXL0630-6R8-M]
Q4  BSS8402DW-7-F  [SOT65P210X110-6N]  (parts A,B of 2)
Q5  2N7002  [SOT95P230X110-3N]
R57  0603,158K,1%  [RESC1608X90N]
R58  0603,30K,1%  [RESC1608X90N]
R59  0603,10K,1%  [RESC1608X90N]
R60  0603,1K,1%  [RESC1608X90N]
R61  0603,10K,1%  [RESC1608X90N]
R62  0603,120R,1%  [RESC1608X90N]
R63  0603,10K,1%  [RESC1608X90N]

### Ports
BUZZER (in, see TopLevel[3D]), VBAT SENSE (out, see TopLevel[3D], STM32H745[5D]), VBAT SENSE EN (in, see TopLevel[3D])

### Nets
+3V3: D3.1(K)
+5V: BZ1.1 C64.2 C65.2 C66.2 D2.1(K) IC13.1(FB) L2.2 R57.2
DGND: C63.1 C64.1 C65.1 IC13.4(GND) J14.4(-) Q4.1(S1) Q5.2(S) R58.1 R61.1 R62.1 R63.1
VBAT: C63.2 IC13.2(EN) IC13.3(VIN) J14.3(+) Q4.4(S2) R59.2
ADC1_INP9: D3.2(A) R60.1 R62.2 ; port VBAT SENSE
BUZZER_PWM: Q5.1(G) R63.2 ; port BUZZER
PC15: Q4.2(G1) R61.2 ; port VBAT SENSE EN
NetBZ1_2: BZ1.2 D2.2(A) Q5.3(D)
NetC62_1: C62.1 IC13.6(BST)
NetC62_2: C62.2 IC13.5(SW) L2.1
NetC66_1: C66.1 R57.1 R58.2
NetQ4_3: Q4.3(D2) R60.2
NetQ4_5: Q4.5(G2) Q4.6(D1) R59.1

Not connected (* = marked no-connect by the designer): J14 1* 2*

### Library data of the parts
BZ1 = QMB-09B-05: -40℃~+85℃ 2.7kHz 3V~7V 5.7mm 5V 60mA 80dB 9mm Electromagnetic Passive (Externally Driven) 插件,D=9mm Buzzers ROHS; LCSC Part #: C161819; Manu Part #: QMB-09B-05
C62 = CC0603KRX7R9BB104: as C2 on sheet TopLevel; LCSC Part #: C14663; Manu Part #: CC0603KRX7R9BB104
C63 = GRM21BR61H106KE43L: 10uF 50V X5R ±10% 0805 Multilayer Ceramic Capacitors MLCC - SMD/SMT ROHS; LCSC Part #: C440198; Manu Part #: GRM21BR61H106KE43L
C64 C65 = CL21A226MAQNNNE: 22uF ±20% 25V Ceramic Capacitor X5R 0805; LCSC Part #: C45783; Manu Part #: CL21A226MAQNNNE
C66 = CL10C470JB8NNNC: as C46 on sheet MAX M10S; Manu Part #: CL10C470JB8NNNC; LCSC Part #: C1671
D2 D3 = BAT54XV2T1G: Diode 30V 200mA Surface Mount SOD-523; Manu Part #: BAT54XV2T1G; LCSC Part #: C81572
IC13 = AP63300WU-7: 3.8V to 32V Input, 3A Low IQ Synchronous Buck Converter with Enhanced EMI Reduction; Manu Part #: AP63300WU-7; LCSC Part #: C2158012
J14 = XT60PW-F_C428722: Horizontal plug Yellow - Power connector / plug connector; LCSC Part #: C428722; Manu Part #: XT60PW-F
L2 = FXL0630-6R8-M: 48mΩ 5A 6.8uH 6A Molded Inductor ±20% SMD,7x6.6mm Power Inductors ROHS; Manu Part #: FXL0630-6R8-M; LCSC Part #: C167221
Q4 = BSS8402DW-7-F: N-Channel+P-Channel Array 60V 130mA 200mW Surface Mount SOT-363; Manu Part #: BSS8402DW-7-F; LCSC Part #: C156386
Q5 = 2N7002: as Q1 on sheet Ethernet Phy; Manu Part #: 2N7002; LCSC Part #: C8545
R57 = 0603WAF1583T5E: -55℃~+155℃ 100mW 158kΩ 75V Thick Film Resistor ±1% ±100ppm/℃ 0603 Chip Resistor - Surface Mount ROHS; Manu Part #: 0603WAF1583T5E; LCSC Part #: C22883
R58 = 0603WAF3002T5E: -55℃~+155℃ 100mW 30kΩ 75V Thick Film Resistor ±1% ±100ppm/℃ 0603 Chip Resistor - Surface Mount ROHS; LCSC Part #: C22984; Manu Part #: 0603WAF3002T5E
R59 R61 R63 = 0603WAF1002T5E: as R3 on sheet STM32H745; LCSC Part #: C25804; Manu Part #: 0603WAF1002T5E
R60 = 0603WAF1001T5E: as R4 on sheet STM32H745; LCSC Part #: C21190; Manu Part #: 0603WAF1001T5E
R62 = 0603WAF1200T5E: -55℃~+155℃ 100mW 120Ω 75V Thick Film Resistor ±1% ±100ppm/℃ 0603 Chip Resistor - Surface Mount ROHS; Manu Part #: 0603WAF1200T5E; LCSC Part #: C22787

## Sheet RGB-LED.SchDoc
size A; SheetNumber: 14; SheetTotal: 14
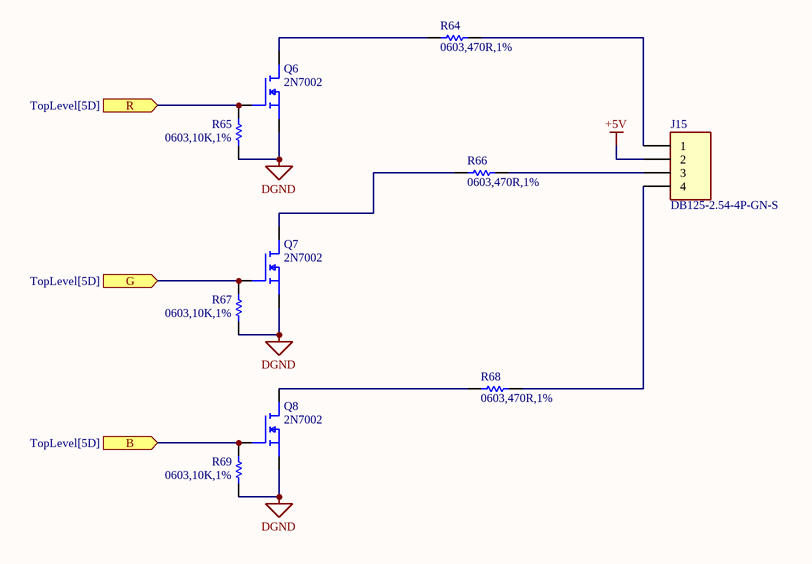
[diagram p14: RGB-LED.SchDoc]

### Parts
J15  DB125-2.54-4P-GN-S  [DB125-2_54-4P-GN]
Q6  2N7002  [SOT95P230X110-3N]
Q7  2N7002  [SOT95P230X110-3N]
Q8  2N7002  [SOT95P230X110-3N]
R64  0603,470R,1%  [RESC1608X90N]
R65  0603,10K,1%  [RESC1608X90N]
R66  0603,470R,1%  [RESC1608X90N]
R67  0603,10K,1%  [RESC1608X90N]
R68  0603,470R,1%  [RESC1608X90N]
R69  0603,10K,1%  [RESC1608X90N]

### Ports
B (in, see TopLevel[5D]), G (in, see TopLevel[5D]), R (in, see TopLevel[5D])

### Nets
+5V: J15.2
DGND: Q6.2(S) Q7.2(S) Q8.2(S) R65.1 R67.1 R69.1
RGB_B: Q7.1(G) R67.2 ; port G
RGB_G: Q6.1(G) R65.2 ; port R
RGB_R: Q8.1(G) R69.2 ; port B
NetJ15_1: J15.1 R64.2
NetJ15_3: J15.3 R66.2
NetJ15_4: J15.4 R68.2
NetQ6_3: Q6.3(D) R64.1
NetQ7_3: Q7.3(D) R66.1
NetQ8_3: Q8.3(D) R68.1

### Library data of the parts
J15 = DB125-2.54-4P-GN-S: 4 Position Wire to Board Terminal Block Through Hole 2.54mm; LCSC Part #: C918122; Manu Part #: DB125-2.54-4P-GN-S
Q6-Q8 = 2N7002: as Q1 on sheet Ethernet Phy; Manu Part #: 2N7002; LCSC Part #: C8545
R64 R66 R68 = 0603WAF4700T5E: as R1 on sheet TopLevel; LCSC Part #: C23179; Manu Part #: 0603WAF4700T5E
R65 R67 R69 = 0603WAF1002T5E: as R3 on sheet STM32H745; LCSC Part #: C25804; Manu Part #: 0603WAF1002T5E